# Altium project SDR_LAPAC.PrjPcb (part 1 of 4)
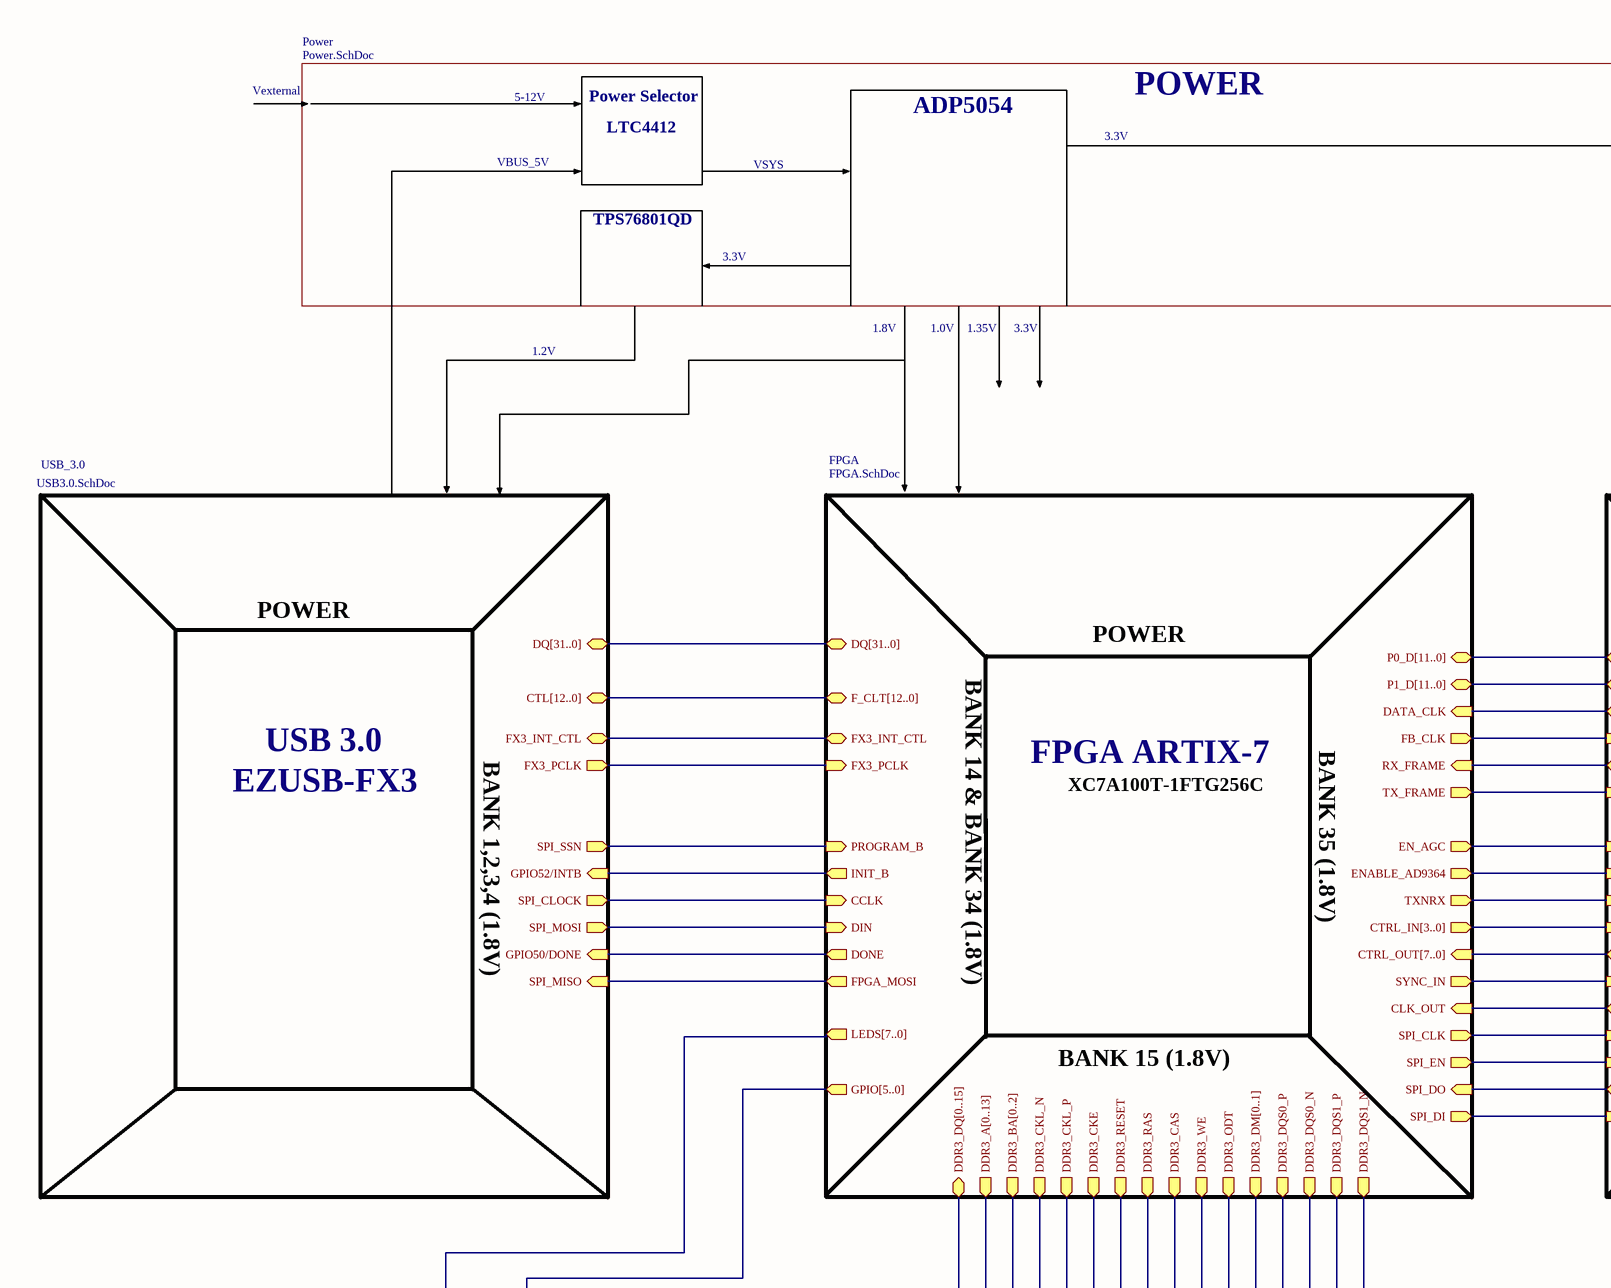
[diagram p0: Intro.SchDoc, top left]
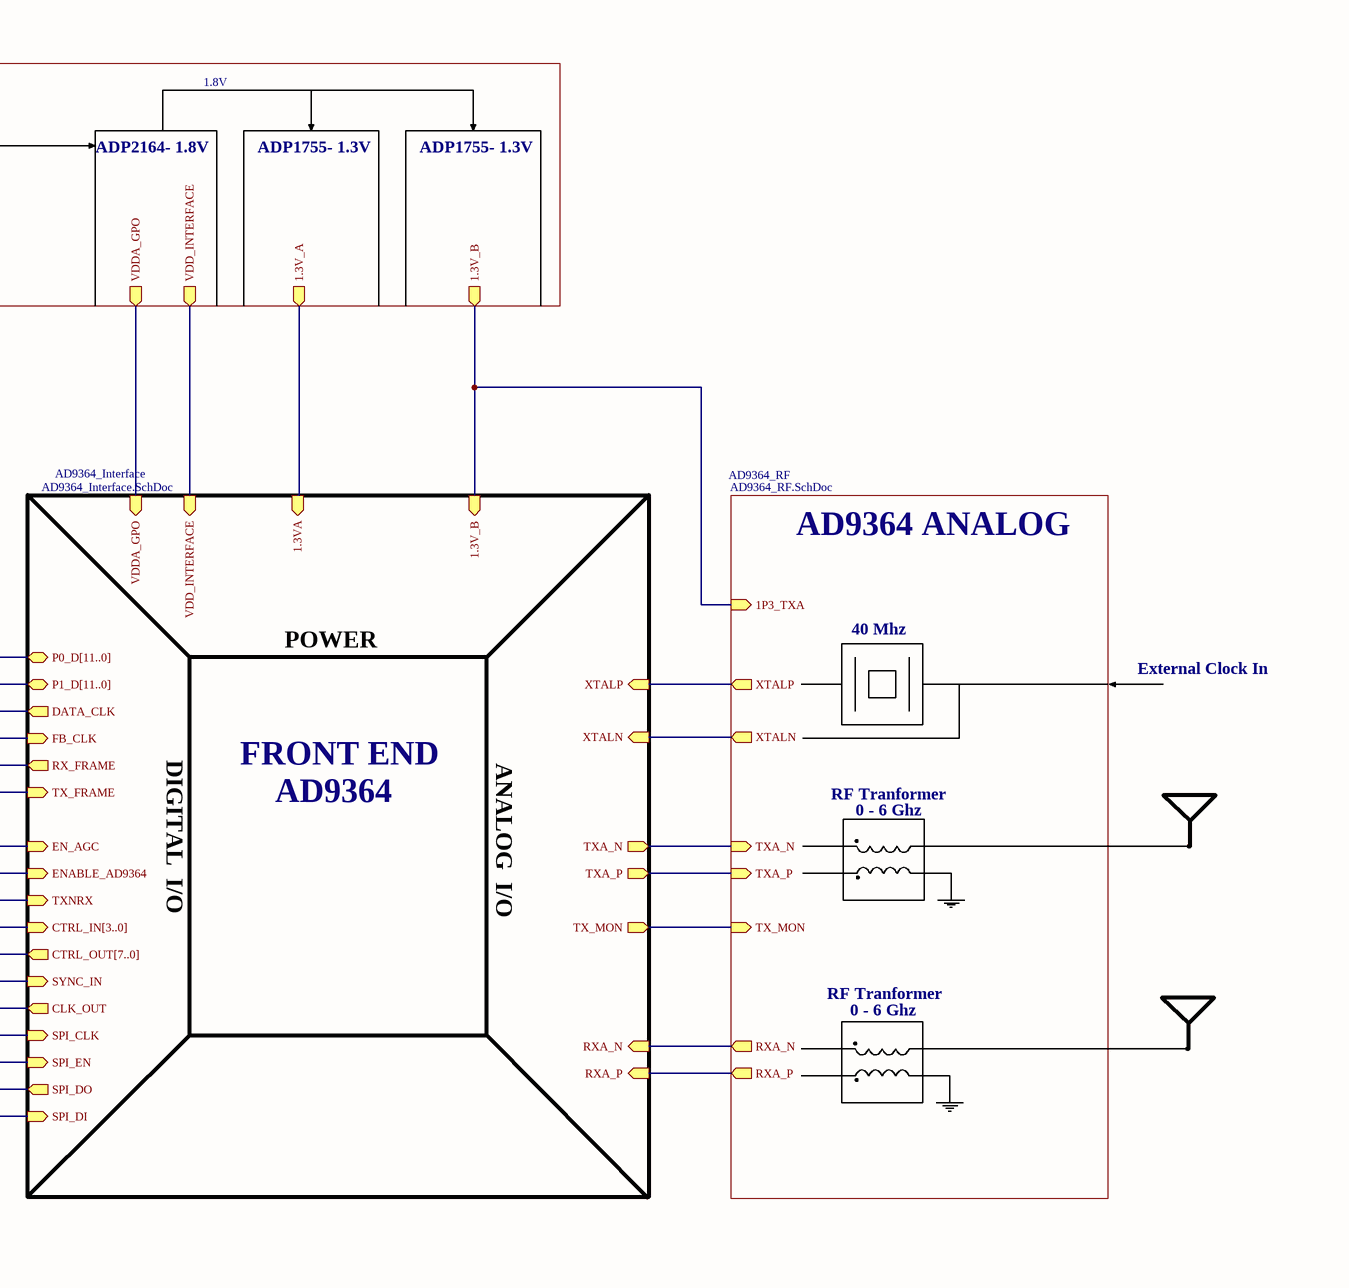
[diagram p1: Intro.SchDoc, top right]
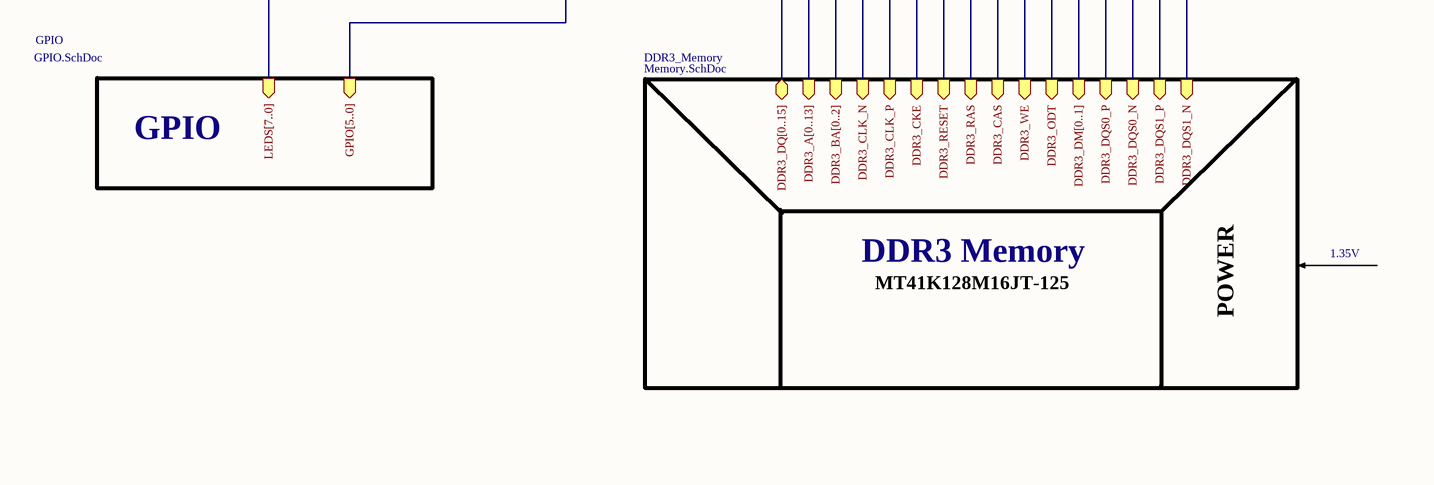
[diagram p2: Intro.SchDoc, bottom left]
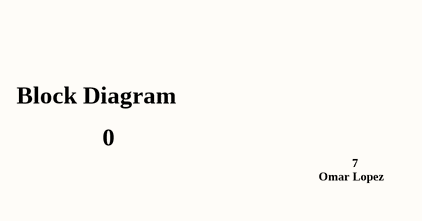
[diagram p3: Intro.SchDoc, bottom right]
8 sheets, 407 parts. Net scope: hierarchical (ports join the sheet entries above them; power ports are global).
Board file: PCB_SDR.PcbDoc
Sheets:
  Intro.SchDoc
    AD9364_Interface = AD9364_Interface.SchDoc
    USB_3.0 = USB3.0.SchDoc
    FPGA = FPGA.SchDoc
    Power = Power.SchDoc
    AD9364_RF = AD9364_RF.SchDoc
    DDR3_Memory = Memory.SchDoc
    GPIO = GPIO.SchDoc

## Sheet Intro.SchDoc
size D; DocumentNumber: 1; SheetNumber: 1

### Sub-sheets
AD9364_Interface = AD9364_Interface.SchDoc: P0_D[11..0] (bidir), P1_D[11..0] (bidir), CTRL_IN[3..0] (in), CTRL_OUT[7..0] (out), DATA_CLK (out), FB_CLK (in), RX_FRAME (out), TX_FRAME (in), ENABLE_AD9364 (in), EN_AGC (in), TXNRX (in), SPI_EN (in), SPI_CLK (in), SPI_DI (in), SPI_DO (out), SYNC_IN (in), CLK_OUT (out), VDD_INTERFACE (in), 1.3V_B (in), 1.3VA (in), VDDA_GPO (in), XTALN (in), XTALP (in), TXA_N (out), TXA_P (out), TX_MON (out), RXA_N (in), RXA_P (in)
AD9364_RF = AD9364_RF.SchDoc: XTALN (out), TXA_N (in), XTALP (out), TXA_P (in), TX_MON (in), RXA_N (out), RXA_P (out), 1P3_TXA (in)
DDR3_Memory = Memory.SchDoc: DDR3_DQ[0..15] (bidir), DDR3_A[0..13] (in), DDR3_BA[0..2] (in), DDR3_CLK_N (in), DDR3_CKE (in), DDR3_RESET (in), DDR3_RAS (in), DDR3_CAS (in), DDR3_WE (in), DDR3_ODT (in), DDR3_DM[0..1] (in), DDR3_DQS0_P (in), DDR3_DQS1_P (in), DDR3_DQS0_N (in), DDR3_DQS1_N (in), DDR3_CLK_P (in)
FPGA = FPGA.SchDoc: P0_D[11..0] (bidir), P1_D[11..0] (bidir), DATA_CLK (in), FB_CLK (out), RX_FRAME (in), TXNRX (out), TX_FRAME (out), EN_AGC (out), ENABLE_AD9364 (out), F_CLT[12..0] (bidir), DQ[31..0] (bidir), FX3_INT_CTL (bidir), FX3_PCLK (in), SPI_DO (in), SPI_EN (out), SPI_CLK (out), CLK_OUT (in), SYNC_IN (out), CTRL_OUT[7..0] (in), CTRL_IN[3..0] (out), SPI_DI (out), DDR3_DQ[0..15] (bidir), DDR3_A[0..13] (out), DDR3_BA[0..2] (out), DDR3_CKL_N (out), DDR3_CKE (out), DDR3_RESET (out), DDR3_RAS (out), DDR3_CAS (out), DDR3_WE (out), DDR3_ODT (out), DDR3_DM[0..1] (out), DDR3_DQS0_P (out), DDR3_DQS1_P (out), DDR3_DQS0_N (out), DDR3_DQS1_N (out), DDR3_CKL_P (out), LEDS[7..0] (out), PROGRAM_B (in), INIT_B (out), CCLK (in), DIN (in), DONE (out), FPGA_MOSI (out), GPIO[5..0] (out)
GPIO = GPIO.SchDoc: LEDS[7..0] (in), GPIO[5..0] (in)
Power = Power.SchDoc: VDD_INTERFACE (out), VDDA_GPO (out), 1.3V_A (out), 1.3V_B (out)
USB_3.0 = USB3.0.SchDoc: FX3_INT_CTL (bidir), FX3_PCLK (out), DQ[31..0] (bidir), CTL[12..0] (bidir), SPI_SSN (out), GPIO52/INTB (in), SPI_CLOCK (out), SPI_MOSI (out), GPIO50/DONE (in), SPI_MISO (in)

### Nets
1.3V_A: sheet AD9364_Interface/1.3VA, sheet Power/1.3V_A
1.3V_B: sheet AD9364_Interface/1.3V_B, sheet Power/1.3V_B, sheet AD9364_RF/1P3_TXA
C_RXA_N: sheet AD9364_Interface/RXA_N, sheet AD9364_RF/RXA_N
C_RXA_P: sheet AD9364_Interface/RXA_P, sheet AD9364_RF/RXA_P
C_TXA_N: sheet AD9364_Interface/TXA_N, sheet AD9364_RF/TXA_N
C_TXA_P: sheet AD9364_Interface/TXA_P, sheet AD9364_RF/TXA_P
CLK_OUT: sheet AD9364_Interface/CLK_OUT, sheet FPGA/CLK_OUT
DATA_CLK: sheet AD9364_Interface/DATA_CLK, sheet FPGA/DATA_CLK
DDR3_CAS: sheet FPGA/DDR3_CAS, sheet DDR3_Memory/DDR3_CAS
DDR3_CKE: sheet FPGA/DDR3_CKE, sheet DDR3_Memory/DDR3_CKE
DDR3_CKL_N: sheet FPGA/DDR3_CKL_N, sheet DDR3_Memory/DDR3_CLK_N
DDR3_CKL_P: sheet FPGA/DDR3_CKL_P, sheet DDR3_Memory/DDR3_CLK_P
DDR3_DQS0_N: sheet FPGA/DDR3_DQS0_N, sheet DDR3_Memory/DDR3_DQS0_N
DDR3_DQS0_P: sheet FPGA/DDR3_DQS0_P, sheet DDR3_Memory/DDR3_DQS0_P
DDR3_DQS1_N: sheet FPGA/DDR3_DQS1_N, sheet DDR3_Memory/DDR3_DQS1_N
DDR3_DQS1_P: sheet FPGA/DDR3_DQS1_P, sheet DDR3_Memory/DDR3_DQS1_P
DDR3_ODT: sheet FPGA/DDR3_ODT, sheet DDR3_Memory/DDR3_ODT
DDR3_RAS: sheet FPGA/DDR3_RAS, sheet DDR3_Memory/DDR3_RAS
DDR3_RESET: sheet FPGA/DDR3_RESET, sheet DDR3_Memory/DDR3_RESET
DDR3_WE: sheet FPGA/DDR3_WE, sheet DDR3_Memory/DDR3_WE
EN_AGC: sheet AD9364_Interface/EN_AGC, sheet FPGA/EN_AGC
ENABLE_AD9364: sheet AD9364_Interface/ENABLE_AD9364, sheet FPGA/ENABLE_AD9364
F_FB_CLK: sheet AD9364_Interface/FB_CLK, sheet FPGA/FB_CLK
F_INT_CTL: sheet USB_3.0/FX3_INT_CTL, sheet FPGA/FX3_INT_CTL
F_PCLK: sheet USB_3.0/FX3_PCLK, sheet FPGA/FX3_PCLK
F_RX_FRAME: sheet AD9364_Interface/RX_FRAME, sheet FPGA/RX_FRAME
F_TX_FRAME: sheet AD9364_Interface/TX_FRAME, sheet FPGA/TX_FRAME
FPGA_CCLK: sheet USB_3.0/SPI_CLOCK, sheet FPGA/CCLK
FPGA_DONE: sheet USB_3.0/GPIO50/DONE, sheet FPGA/DONE
FPGA_PROGRA_B: sheet USB_3.0/SPI_SSN, sheet FPGA/PROGRAM_B
FPGA_SPI_MISO: sheet USB_3.0/SPI_MOSI, sheet FPGA/DIN
FPGA_SPI_MOSI: sheet USB_3.0/SPI_MISO, sheet FPGA/FPGA_MOSI
FX3_GPIO52: sheet USB_3.0/GPIO52/INTB, sheet FPGA/INIT_B
SPI_CLK: sheet AD9364_Interface/SPI_CLK, sheet FPGA/SPI_CLK
SPI_DI: sheet AD9364_Interface/SPI_DI, sheet FPGA/SPI_DI
SPI_DO: sheet AD9364_Interface/SPI_DO, sheet FPGA/SPI_DO
SPI_EN: sheet AD9364_Interface/SPI_EN, sheet FPGA/SPI_EN
SYNC_IN_F: sheet AD9364_Interface/SYNC_IN, sheet FPGA/SYNC_IN
TX_MON: sheet AD9364_Interface/TX_MON, sheet AD9364_RF/TX_MON
TXNRX: sheet AD9364_Interface/TXNRX, sheet FPGA/TXNRX
VDD_INTERFACE: sheet AD9364_Interface/VDD_INTERFACE, sheet Power/VDD_INTERFACE
VDDA_GPO: sheet AD9364_Interface/VDDA_GPO, sheet Power/VDDA_GPO
XTAL_N: sheet AD9364_Interface/XTALN, sheet AD9364_RF/XTALN
XTAL_P: sheet AD9364_Interface/XTALP, sheet AD9364_RF/XTALP

### Buses and harness runs
bus sheet AD9364_Interface/CTRL_IN[3..0] = sheet FPGA/CTRL_IN[3..0]
bus sheet AD9364_Interface/CTRL_OUT[7..0] = sheet FPGA/CTRL_OUT[7..0]
bus sheet AD9364_Interface/P0_D[11..0] = sheet FPGA/P0_D[11..0]
bus sheet AD9364_Interface/P1_D[11..0] = sheet FPGA/P1_D[11..0]
bus sheet DDR3_Memory/DDR3_A[0..13] = sheet FPGA/DDR3_A[0..13]
bus sheet DDR3_Memory/DDR3_BA[0..2] = sheet FPGA/DDR3_BA[0..2]
bus sheet DDR3_Memory/DDR3_DM[0..1] = sheet FPGA/DDR3_DM[0..1]
bus sheet DDR3_Memory/DDR3_DQ[0..15] = sheet FPGA/DDR3_DQ[0..15]
bus sheet FPGA/DQ[31..0] = sheet USB_3.0/DQ[31..0]
bus sheet FPGA/F_CLT[12..0] = sheet USB_3.0/CTL[12..0]
bus sheet FPGA/GPIO[5..0] = sheet GPIO/GPIO[5..0]
bus sheet FPGA/LEDS[7..0] = sheet GPIO/LEDS[7..0]

### Notes on the sheet
- Vexternal
- 5-12V
- Power Selector
- LTC4412
- ADP5054
- 3.3V
- POWER
- 1.8V
- VBUS_5V
- VSYS
- ADP2164- 1.8V
- ADP1755- 1.3V
- TPS76801QD
- 1.0V
- 1.35V
- 1.2V
- AD9364 ANALOG
- 40 Mhz
- External Clock In
- EZUSB-FX3
- USB 3.0
- FPGA ARTIX-7
- XC7A100T-1FTG256C
- FRONT END
- AD9364
- RF Tranformer
- 0 - 6 Ghz
- BANK 1,2,3,4 (1.8V)
- BANK 14 & BANK 34 (1.8V)
- BANK 35 (1.8V)
- DIGITAL  I/O
- ANALOG  I/O
- BANK 15 (1.8V)
- GPIO
- DDR3 Memory
- MT41K128M16JT-125
- Block Diagram
- 0
- Omar Lopez
- 7

## Sheet AD9364_Interface.SchDoc
size C; DocumentNumber: 5; SheetNumber: 5
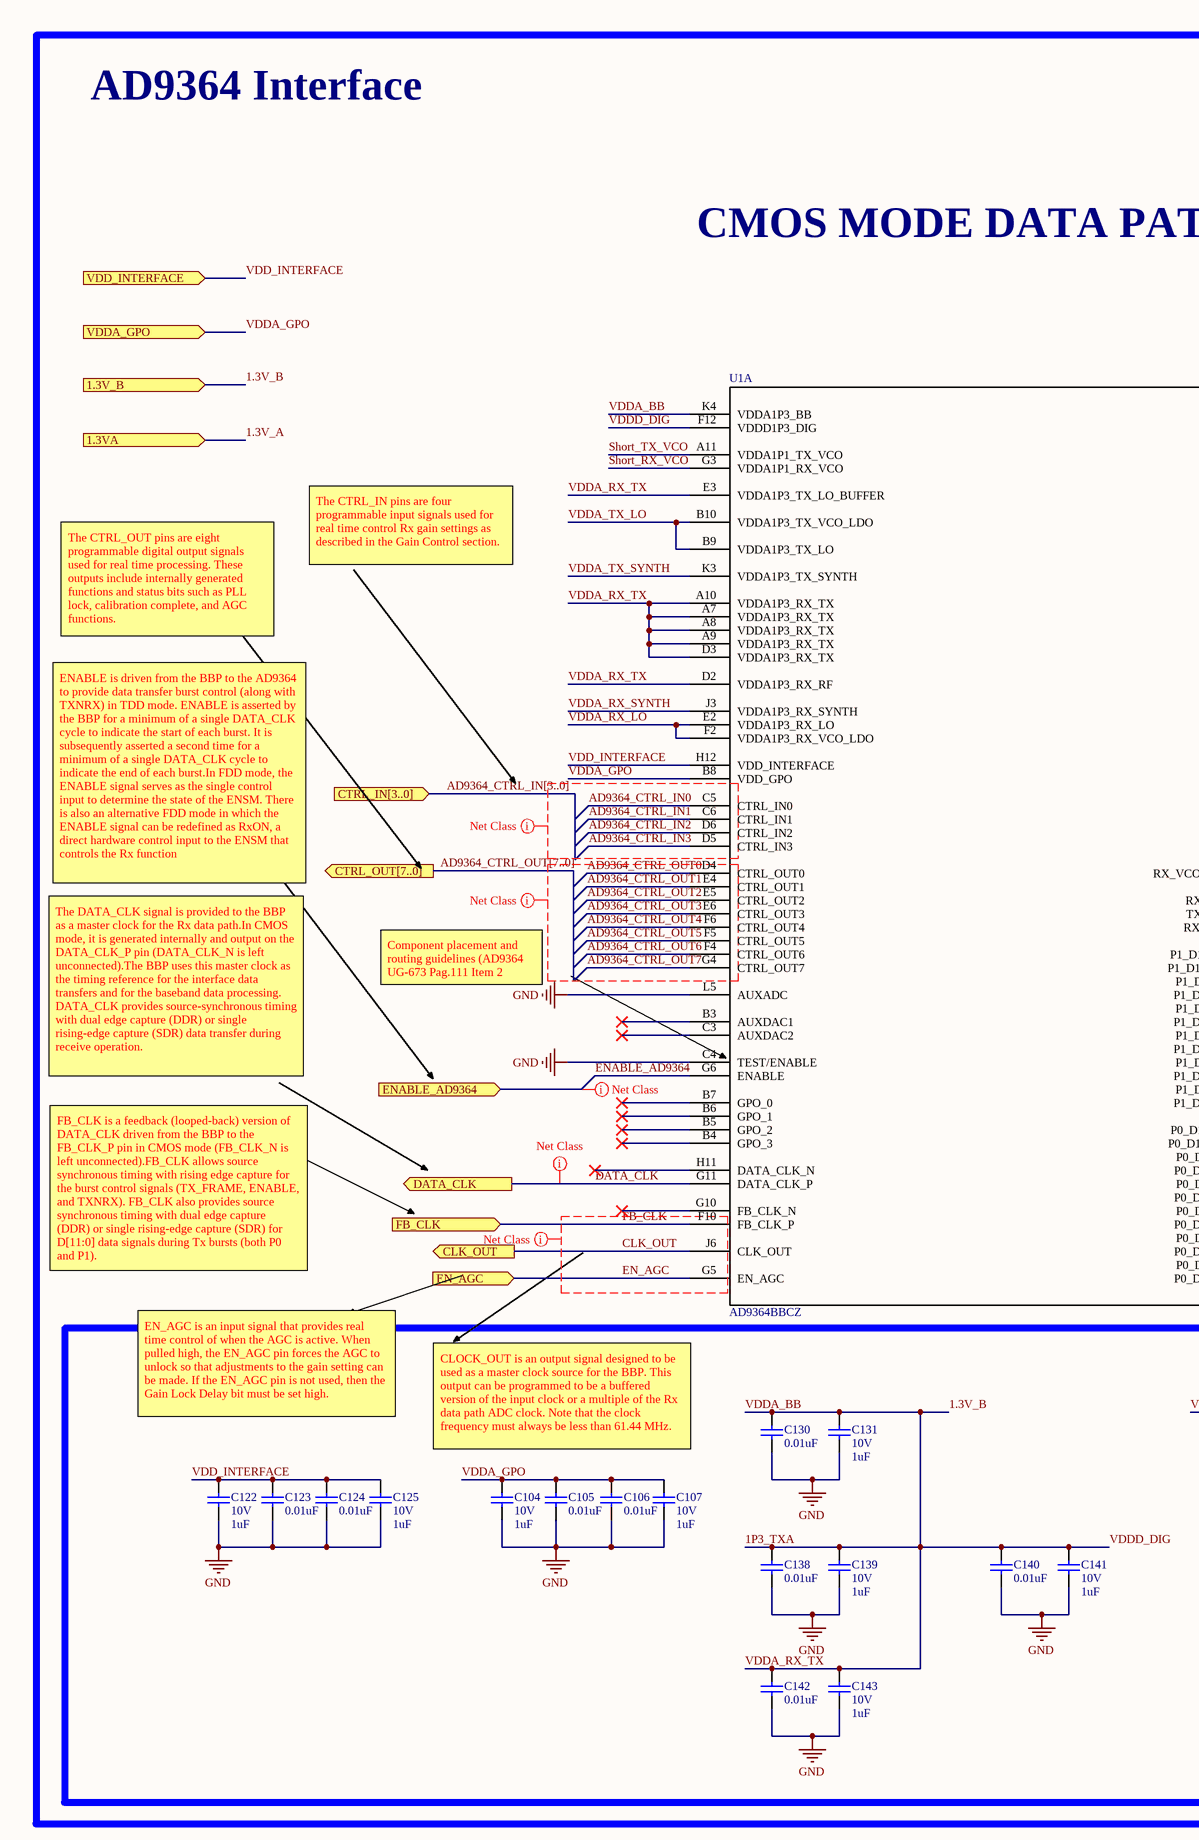
[diagram p4: AD9364_Interface.SchDoc, left]
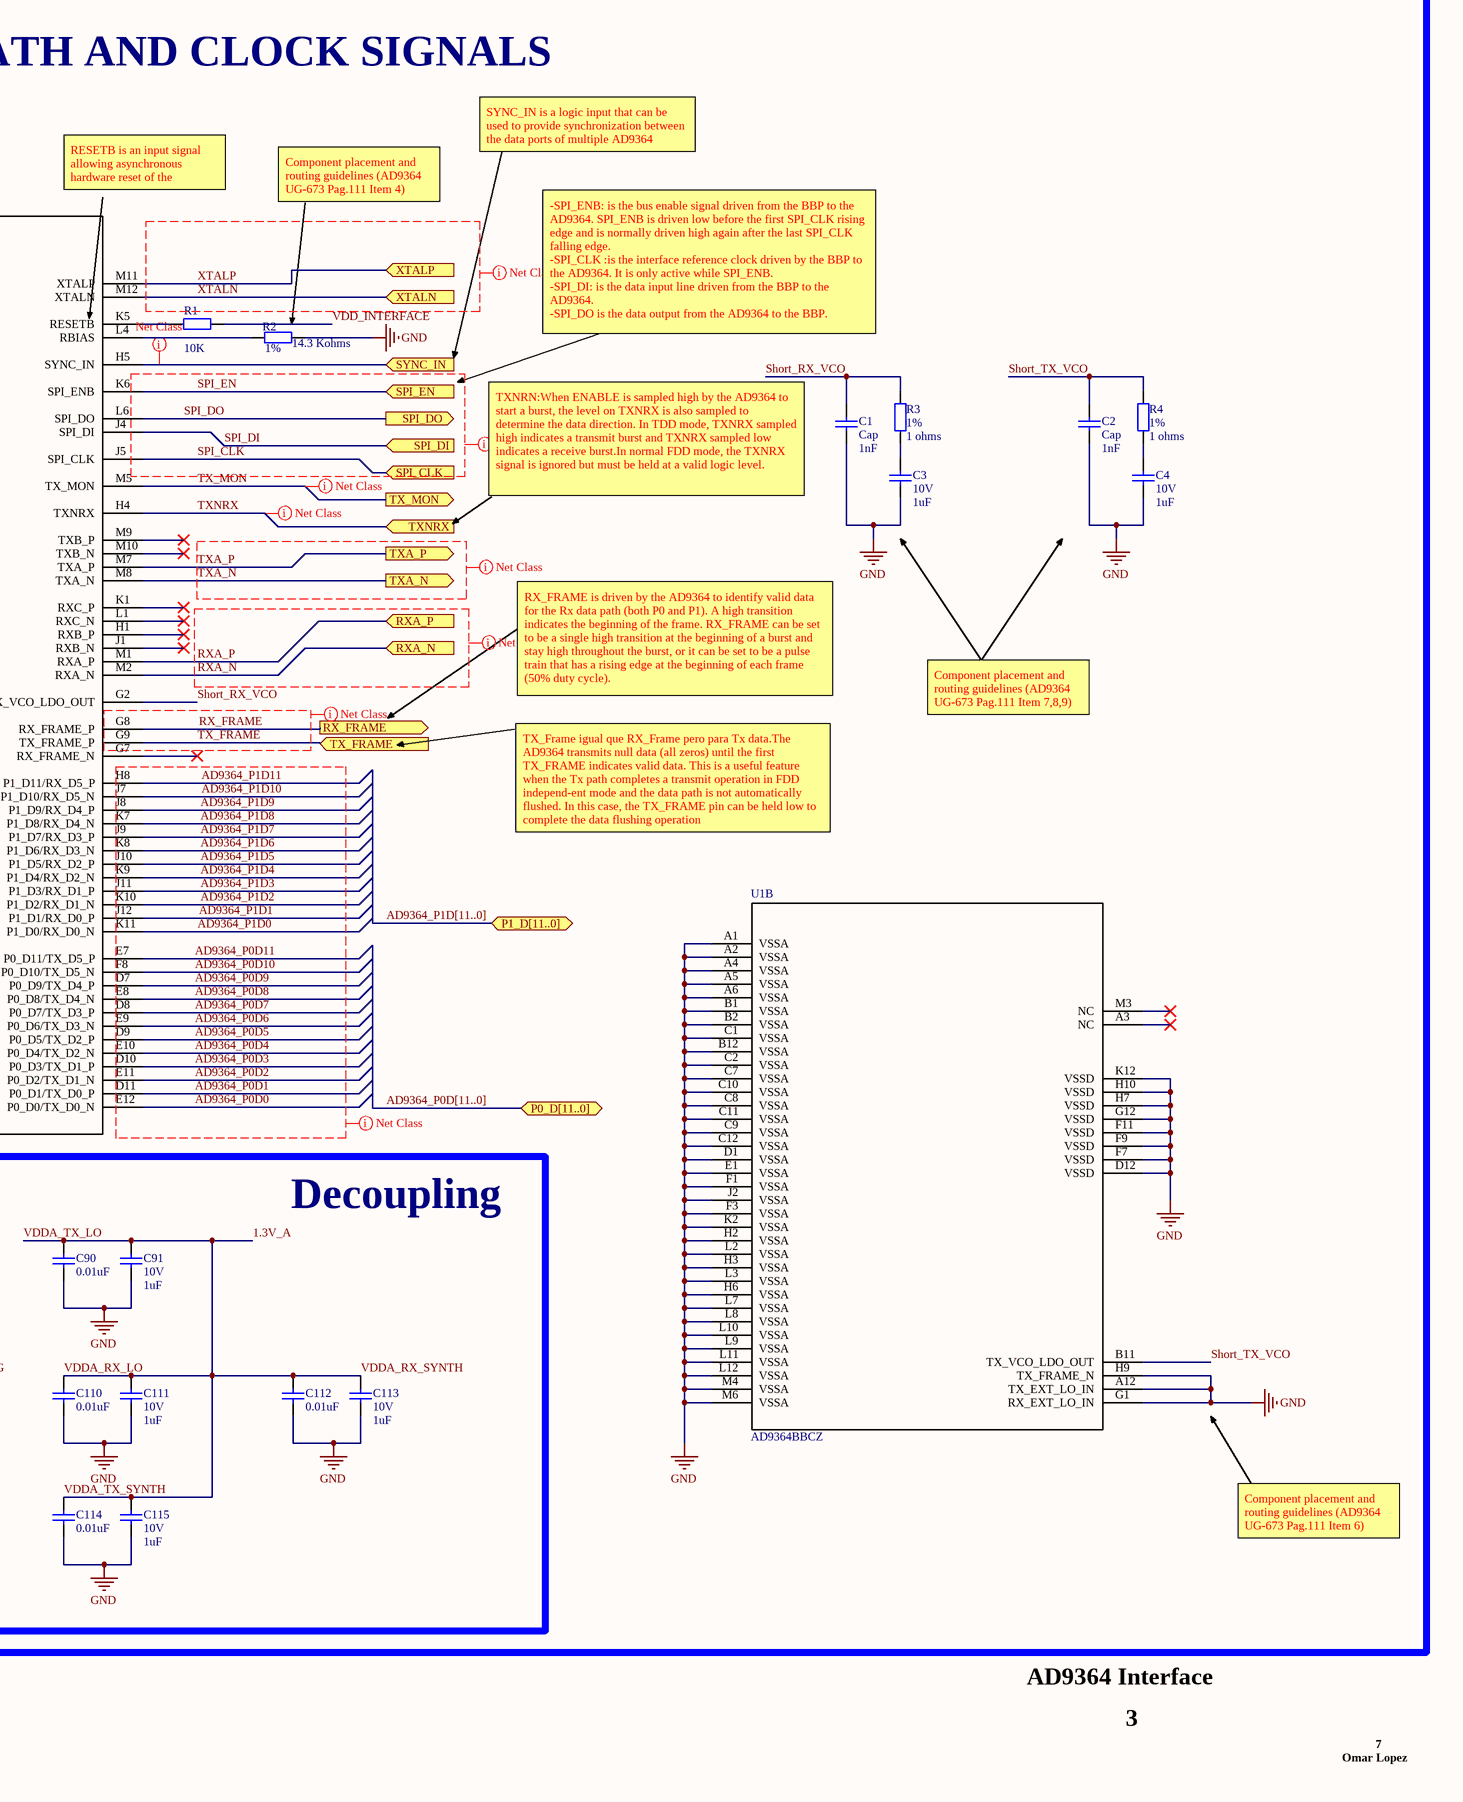
[diagram p5: AD9364_Interface.SchDoc, right]

### Parts
C1  Cap  value 1nF  [GRM0402MurataCap]
C2  Cap  value 1nF  [GRM0402MurataCap]
C3  10V  value 1uF  [GRM0402MurataCap]
C4  10V  value 1uF  [GRM0402MurataCap]
C90  value 0.01uF  [GRM0402MurataCap]  (hidden comment: Cap)
C91  10V  value 1uF  [GRM0402MurataCap]
C104  10V  value 1uF  [GRM0402MurataCap]
C105  value 0.01uF  [GRM0402MurataCap]  (hidden comment: Cap)
C106  value 0.01uF  [GRM0402MurataCap]  (hidden comment: Cap)
C107  10V  value 1uF  [GRM0402MurataCap]
C110  value 0.01uF  [GRM0402MurataCap]  (hidden comment: Cap)
C111  10V  value 1uF  [GRM0402MurataCap]
C112  value 0.01uF  [GRM0402MurataCap]  (hidden comment: Cap)
C113  10V  value 1uF  [GRM0402MurataCap]
C114  value 0.01uF  [GRM0402MurataCap]  (hidden comment: Cap)
C115  10V  value 1uF  [GRM0402MurataCap]
C122  10V  value 1uF  [GRM0402MurataCap]
C123  value 0.01uF  [GRM0402MurataCap]  (hidden comment: Cap)
C124  value 0.01uF  [GRM0402MurataCap]  (hidden comment: Cap)
C125  10V  value 1uF  [GRM0402MurataCap]
C130  value 0.01uF  [GRM0402MurataCap]  (hidden comment: Cap)
C131  10V  value 1uF  [GRM0402MurataCap]
C138  value 0.01uF  [GRM0402MurataCap]  (hidden comment: Cap)
C139  10V  value 1uF  [GRM0402MurataCap]
C140  value 0.01uF  [GRM0402MurataCap]  (hidden comment: Cap)
C141  10V  value 1uF  [GRM0402MurataCap]
C142  value 0.01uF  [GRM0402MurataCap]  (hidden comment: Cap)
C143  10V  value 1uF  [GRM0402MurataCap]
R1  value 10K  [RC0402N]
R2  1%  value 14.3 Kohms  [RC0402N]
R3  1%  value 1 ohms  [RC0402N]
R4  1%  value 1 ohms  [RC0402N]
U1  AD9364BBCZ  [BC_144_7_]  (parts A,B of 2)

### Blocks framed on the sheet
Decoupling: C90 C91 C104-C107 C110-C115 C122-C125 C130 C131 C138-C143

### Ports
1.3V_B (in), 1.3VA (in), CLK_OUT (out), CTRL_IN[3..0] (in), CTRL_OUT[7..0] (out), DATA_CLK (out), EN_AGC (in), ENABLE_AD9364 (in), FB_CLK (in), P0_D[11..0] (bidir), P1_D[11..0] (bidir), RX_FRAME (out), RXA_N (in), RXA_P (in), SPI_CLK (in), SPI_DI (in), SPI_DO (out), SPI_EN (in), SYNC_IN (in), TX_FRAME (in), TX_MON (out), TXA_N (out), TXA_P (out), TXNRX (in), VDD_INTERFACE (in), VDDA_GPO (in), XTALN (in), XTALP (in)

### Nets
GND: C1.2 C2.2 C3.2 C4.2 C90.1 C91.1 C104.1 C105.1 C106.1 C107.1 C110.1 C111.1 C112.1 C113.1 C114.1 C115.1 C122.1 C123.1 C124.1 C125.1 C130.1 C131.1 C138.1 C139.1 C140.1 C141.1 C142.1 C143.1 R2.1 U1.A1(VSSA) U1.A2(VSSA) U1.A4(VSSA) U1.A5(VSSA) U1.A6(VSSA) U1.A12(TX_EXT_LO_IN) U1.B1(VSSA) U1.B2(VSSA) U1.B12(VSSA) U1.C1(VSSA) U1.C2(VSSA) U1.C4(TEST/ENABLE) U1.C7(VSSA) U1.C8(VSSA) U1.C9(VSSA) U1.C10(VSSA) U1.C11(VSSA) U1.C12(VSSA) U1.D1(VSSA) U1.D12(VSSD) U1.E1(VSSA) U1.F1(VSSA) U1.F3(VSSA) U1.F7(VSSD) U1.F9(VSSD) U1.F11(VSSD) U1.G1(RX_EXT_LO_IN) U1.G12(VSSD) U1.H2(VSSA) U1.H3(VSSA) U1.H6(VSSA) U1.H7(VSSD) U1.H9(TX_FRAME_N) U1.H10(VSSD) U1.J2(VSSA) U1.K2(VSSA) U1.K12(VSSD) U1.L2(VSSA) U1.L3(VSSA) U1.L5(AUXADC) U1.L7(VSSA) U1.L8(VSSA) U1.L9(VSSA) U1.L10(VSSA) U1.L11(VSSA) U1.L12(VSSA) U1.M4(VSSA) U1.M6(VSSA)
1.3V_A: C90.2 C91.2 C110.2 C111.2 C112.2 C113.2 C114.2 C115.2 U1.B9(VDDA1P3_TX_LO) U1.B10(VDDA1P3_TX_VCO_LDO) U1.E2(VDDA1P3_RX_LO) U1.F2(VDDA1P3_RX_VCO_LDO) U1.J3(VDDA1P3_RX_SYNTH) U1.K3(VDDA1P3_TX_SYNTH) ; port 1.3VA  [also labelled VDDA_RX_LO, VDDA_RX_SYNTH, VDDA_TX_LO, VDDA_TX_SYNTH]
1.3V_B: C130.2 C131.2 C138.2 C139.2 C140.2 C141.2 C142.2 C143.2 U1.A7(VDDA1P3_RX_TX) U1.A8(VDDA1P3_RX_TX) U1.A9(VDDA1P3_RX_TX) U1.A10(VDDA1P3_RX_TX) U1.D2(VDDA1P3_RX_RF) U1.D3(VDDA1P3_RX_TX) U1.E3(VDDA1P3_TX_LO_BUFFER) U1.F12(VDDD1P3_DIG) U1.K4(VDDA1P3_BB) ; port 1.3V_B  [also labelled 1P3_TXA, VDDA_BB, VDDA_RX_TX, VDDD_DIG]
AD9364_CTRL_IN0: U1.C5(CTRL_IN0)
AD9364_CTRL_IN1: U1.C6(CTRL_IN1)
AD9364_CTRL_IN2: U1.D6(CTRL_IN2)
AD9364_CTRL_IN3: U1.D5(CTRL_IN3)
AD9364_CTRL_OUT0: U1.D4(CTRL_OUT0)
AD9364_CTRL_OUT1: U1.E4(CTRL_OUT1)
AD9364_CTRL_OUT2: U1.E5(CTRL_OUT2)
AD9364_CTRL_OUT3: U1.E6(CTRL_OUT3)
AD9364_CTRL_OUT4: U1.F6(CTRL_OUT4)
AD9364_CTRL_OUT5: U1.F5(CTRL_OUT5)
AD9364_CTRL_OUT6: U1.F4(CTRL_OUT6)
AD9364_CTRL_OUT7: U1.G4(CTRL_OUT7)
AD9364_P0D0: U1.E12(P0_D0/TX_D0_N)
AD9364_P0D1: U1.D11(P0_D1/TX_D0_P)
AD9364_P0D2: U1.E11(P0_D2/TX_D1_N)
AD9364_P0D3: U1.D10(P0_D3/TX_D1_P)
AD9364_P0D4: U1.E10(P0_D4/TX_D2_N)
AD9364_P0D5: U1.D9(P0_D5/TX_D2_P)
AD9364_P0D6: U1.E9(P0_D6/TX_D3_N)
AD9364_P0D7: U1.D8(P0_D7/TX_D3_P)
AD9364_P0D8: U1.E8(P0_D8/TX_D4_N)
AD9364_P0D9: U1.D7(P0_D9/TX_D4_P)
AD9364_P0D10: U1.F8(P0_D10/TX_D5_N)
AD9364_P0D11: U1.E7(P0_D11/TX_D5_P)
AD9364_P1D0: U1.K11(P1_D0/RX_D0_N)
AD9364_P1D1: U1.J12(P1_D1/RX_D0_P)
AD9364_P1D2: U1.K10(P1_D2/RX_D1_N)
AD9364_P1D3: U1.J11(P1_D3/RX_D1_P)
AD9364_P1D4: U1.K9(P1_D4/RX_D2_N)
AD9364_P1D5: U1.J10(P1_D5/RX_D2_P)
AD9364_P1D6: U1.K8(P1_D6/RX_D3_N)
AD9364_P1D7: U1.J9(P1_D7/RX_D3_P)
AD9364_P1D8: U1.K7(P1_D8/RX_D4_N)
AD9364_P1D9: U1.J8(P1_D9/RX_D4_P)
AD9364_P1D10: U1.J7(P1_D10/RX_D5_N)
AD9364_P1D11: U1.H8(P1_D11/RX_D5_P)
CLK_OUT: U1.J6(CLK_OUT) ; port CLK_OUT
DATA_CLK: U1.G11(DATA_CLK_P) ; port DATA_CLK
EN_AGC: U1.G5(EN_AGC) ; port EN_AGC
ENABLE_AD9364: U1.G6(ENABLE) ; port ENABLE_AD9364
FB_CLK: U1.F10(FB_CLK_P) ; port FB_CLK  [project net F_FB_CLK]
RX_FRAME: U1.G8(RX_FRAME_P) ; port RX_FRAME  [project net F_RX_FRAME]
RXA_N: U1.M2(RXA_N) ; port RXA_N  [project net C_RXA_N]
RXA_P: U1.M1(RXA_P) ; port RXA_P  [project net C_RXA_P]
Short_RX_VCO: C1.1 R3.1 U1.G2(RX_VCO_LDO_OUT) U1.G3(VDDA1P1_RX_VCO)
Short_TX_VCO: C2.1 R4.1 U1.A11(VDDA1P1_TX_VCO) U1.B11(TX_VCO_LDO_OUT)
SPI_CLK: U1.J5(SPI_CLK) ; port SPI_CLK
SPI_DI: U1.J4(SPI_DI) ; port SPI_DI
SPI_DO: U1.L6(SPI_DO) ; port SPI_DO
SPI_EN: U1.K6(SPI_ENB) ; port SPI_EN
SYNC_IN_F: U1.H5(SYNC_IN) ; port SYNC_IN
TX_FRAME: U1.G9(TX_FRAME_P) ; port TX_FRAME  [project net F_TX_FRAME]
TX_MON: U1.M5(TX_MON) ; port TX_MON
TXA_N: U1.M8(TXA_N) ; port TXA_N  [project net C_TXA_N]
TXA_P: U1.M7(TXA_P) ; port TXA_P  [project net C_TXA_P]
TXNRX: U1.H4(TXNRX) ; port TXNRX
VDD_INTERFACE: C122.2 C123.2 C124.2 C125.2 R1.1 U1.H12(VDD_INTERFACE) ; port VDD_INTERFACE
VDDA_GPO: C104.2 C105.2 C106.2 C107.2 U1.B8(VDD_GPO) ; port VDDA_GPO
XTALN: U1.M12(XTALN) ; port XTALN  [project net XTAL_N]
XTALP: U1.M11(XTALP) ; port XTALP  [project net XTAL_P]
NetC3_1: C3.1 R3.2
NetC4_1: C4.1 R4.2
NetR1_2: R1.2 U1.K5(RESETB)
NetR2_2: R2.2 U1.L4(RBIAS)

Not connected (* = marked no-connect by the designer): U1 A3(NC)* B3(AUXDAC1)* B4(GPO_3)* B5(GPO_2)* B6(GPO_1)* B7(GPO_0)* C3(AUXDAC2)* G7(RX_FRAME_N)* G10(FB_CLK_N)* H1(RXB_P)* H11(DATA_CLK_N)* J1(RXB_N)* K1(RXC_P)* L1(RXC_N)* M3(NC)* M9(TXB_P)* M10(TXB_N)*

### Buses and harness runs
bus AD9364_CTRL_IN[3..0] = port CTRL_IN[3..0]
bus AD9364_CTRL_OUT[7..0] = port CTRL_OUT[7..0]
bus AD9364_P0D[11..0] = port P0_D[11..0]
bus AD9364_P1D[11..0] = port P1_D[11..0]

### Layout directives
net class AD9364_Digital; net class AD9364_DataPorts: AD9364_P0D0, AD9364_P0D1, AD9364_P0D2, AD9364_P0D3, AD9364_P0D4, AD9364_P0D5, AD9364_P0D6, AD9364_P0D7, AD9364_P0D8, AD9364_P0D9, AD9364_P0D10, AD9364_P0D11, AD9364_P1D0, AD9364_P1D1, AD9364_P1D2, AD9364_P1D3, AD9364_P1D4, AD9364_P1D5, AD9364_P1D6, AD9364_P1D7, AD9364_P1D8, AD9364_P1D9, AD9364_P1D10, AD9364_P1D11
net class AD9364_Digital; net class AD9364_CTRL_OUT[7..0]: AD9364_CTRL_OUT0, AD9364_CTRL_OUT1, AD9364_CTRL_OUT2, AD9364_CTRL_OUT3, AD9364_CTRL_OUT4, AD9364_CTRL_OUT5, AD9364_CTRL_OUT6, AD9364_CTRL_OUT7
net class AD9364_Digital; net class AD9364_SPI_4Wires: SPI_CLK, SPI_DI, SPI_DO, SPI_EN
net class AD9364_Digital; net class AD9364_Other: CLK_OUT, DATA_CLK, EN_AGC, ENABLE_AD9364, FB_CLK, RX_FRAME, SYNC_IN_F, TX_FRAME, TXNRX
net class AD9364_Digital; net class AD9364_CTRL_IN[3..0]: AD9364_CTRL_IN0, AD9364_CTRL_IN1, AD9364_CTRL_IN2, AD9364_CTRL_IN3
net class AD9364_RF; net class AD9364_Clock: XTALN, XTALP
net class AD9364_RF; net class AD9364_Rx: RXA_N, RXA_P
net class AD9364_RF; net class AD9364_TxMon: TX_MON
net class AD9364_RF; net class AD9364_Tx: TXA_N, TXA_P

### Notes on the sheet
- AD9364 Interface
- CMOS MODE DATA PATH AND CLOCK SIGNALS
- SYNC_IN is a logic input that can be used to provide synchronization between the data ports of multiple AD9364 devices.
- RESETB is an input signal allowing asynchronous hardware reset of the AD9364.
- Component placement and routing guidelines (AD9364 UG-673 Pag.111 Item 4)
- -SPI_ENB: is the bus enable signal driven from the BBP to the AD9364. SPI_ENB is driven low before the first SPI_CLK rising edge and is normally driven high again after the last SPI_CLK falling edge.
  -SPI_CLK :is the interface reference clock driven by the BBP to the AD9364. It is only active while SPI_ENB.
  -SPI_DI: is the data input line driven from the BBP to the AD9364.
  -SPI_DO is the data output from the AD9364 to the BBP.
- The CTRL_IN pins are four programmable input signals used for real time control Rx gain settings as described in the Gain Control section.
- The CTRL_OUT pins are eight programmable digital output signals used for real time processing. These outputs include internally generated functions and status bits such as PLL lock, calibration complete, and AGC functions.
- (near C1) TXNRN:When ENABLE is sampled high by the AD9364 to start a burst, the level on TXNRX is also sampled to determine the data direction. In TDD mode, TXNRX sampled high indicates a transmit burst and TXNRX sampled low indicates a receive burst.In normal FDD mode, the TXNRX signal is ignored but must be held at a valid logic level.
- ENABLE is driven from the BBP to the AD9364 to provide data transfer burst control (along with TXNRX) in TDD mode. ENABLE is asserted by the BBP for a minimum of a single DATA_CLK cycle to indicate the start of each burst. It is subsequently asserted a second time for a minimum of a single DATA_CLK cycle to indicate the end of each burst.In FDD mode, the ENABLE signal serves as the single control input to determine the state of the ENSM. There is also an alternative FDD mode in which the ENABLE signal can be redefined as RxON, a direct hardware control input to the ENSM that controls the Rx function
- RX_FRAME is driven by the AD9364 to identify valid data for the Rx data path (both P0 and P1). A high transition indicates the beginning of the frame. RX_FRAME can be set to be a single high transition at the beginning of a burst and stay high throughout the burst, or it can be set to be a pulse train that has a rising edge at the beginning of each frame (50% duty cycle).
- Component placement and routing guidelines (AD9364 UG-673 Pag.111 Item 7,8,9)
- Component placement and routing guidelines (AD9364 UG-673 Pag.111 Item 2
  )
- TX_Frame igual que RX_Frame pero para Tx data.The AD9364 transmits null data (all zeros) until the first TX_FRAME indicates valid data. This is a useful feature when the Tx path completes a transmit operation in FDD independ-ent mode and the data path is not automatically flushed. In this case, the TX_FRAME pin can be held low to complete the data flushing operation
- The DATA_CLK signal is provided to the BBP as a master clock for the Rx data path.In CMOS mode, it is generated internally and output on the DATA_CLK_P pin (DATA_CLK_N is left unconnected).The BBP uses this master clock as the timing reference for the interface data transfers and for the baseband data processing. DATA_CLK provides source-synchronous timing with dual edge capture (DDR) or single rising-edge capture (SDR) data transfer during receive operation.
- FB_CLK is a feedback (looped-back) version of DATA_CLK driven from the BBP to the FB_CLK_P pin in CMOS mode (FB_CLK_N is left unconnected).FB_CLK allows source synchronous timing with rising edge capture for the burst control signals (TX_FRAME, ENABLE, and TXNRX). FB_CLK also provides source synchronous timing with dual edge capture (DDR) or single rising-edge capture (SDR) for D[11:0] data signals during Tx bursts (both P0 and P1).
- EN_AGC is an input signal that provides real time control of when the AGC is active. When pulled high, the EN_AGC pin forces the AGC to unlock so that adjustments to the gain setting can be made. If the EN_AGC pin is not used, then the Gain Lock Delay bit must be set high.
- CLOCK_OUT is an output signal designed to be used as a master clock source for the BBP. This output can be programmed to be a buffered version of the input clock or a multiple of the Rx data path ADC clock. Note that the clock frequency must always be less than 61.44 MHz.
- Component placement and routing guidelines (AD9364 UG-673 Pag.111 Item 6)
- 3
- Omar Lopez
- 7

### Library data of the parts
C1 C2 = Cap: Capacitor; Manufacturer: Murata; PartNumber: GRM1555C1H102FA01D; Tolerance: 10%; Descripción: 50V SMD; CostoVendedor1: 0.25; Vendedor1: Mouser; Vendedor2: Digi-Key; Package: 0402; DataSheet: http://www.mouser.com/ds/2/281/c02e-2905.pdf; LinkVendedor1: https://ar.mouser.com/ProductDetail/Murata-Electronics/GRM1555C1H102FA01D?qs=sGAEpiMZZMs0AnBnWHyRQHS%2f3XE0oMwxlJflngdMc0Y%3d; Stock1: 95000
C3 C4 C91 C104 C107 C111 C113 C115 C122 C125 C131 C139 C141 C143 = Cap: Capacitor; Manufacturer: Murata; PartNumber: GRM155C81E105KE11D; Tolerance: 10%; Descripción: SMD/SMT 0402 1uF 6.3volts X5R 10%; CostoVendedor2: 0.3; Vendedor1: Mouser; Vendedor2: Digi-Key; Package: 0402; DataSheet: http://www.mouser.com/ds/2/281/c02e-2905.pdf; LinkVendedor2: https://www.digikey.com/product-detail/en/murata-electronics-north-america/GRM155C81E105KE11D/490-10014-1-ND/5026352; Stock2: 4000
C90 C105 C106 C110 C112 C114 C123 C124 C130 C138 C140 C142 = Cap: Capacitor; Manufacturer: Murata; PartNumber: GCG155L81E103KA01D; Tolerance: 10%; Descripción: SMD/SMT 0402 0.01uF 25volts X7R 10%; CostoVendedor1: 0.19; Vendedor1: Mouser; Vendedor2: Digi-Key; Package: 0402; DataSheet: https://ar.mouser.com/datasheet/2/281/c03e-516224.pdf; LinkVendedor1: https://ar.mouser.com/ProductDetail/Murata-Electronics/GCG155L81E103KA01D?qs=sGAEpiMZZMs0AnBnWHyRQID2xuQsFd1G0H3MNkFLCyvrnbiUuoaHUg%3d%3d; Stock1: 8800
R1 = Res2: Resistor; Manufacturer: Panasonic; PartNumber: ERJ-2RKF1002X; Tolerance: 1%; Descripción: 100mW 50V; CostoVendedor1: 0.021; Vendedor1: Mouser; Vendedor2: Digi-Key; Package: 0402; DataSheet: http://www.mouser.com/ds/2/315/AOA0000C86-911473.pdf; LinkVendedor1: https://ar.mouser.com/ProductDetail/Panasonic-Industrial-Devices/ERJ-2RKF1002X?qs=%2fha2pyFadujciewGcSbxYCeocmJ1V0ffuiBNpRUU2nm5e2XaRJ685Q%3d%3d; Stock1: 2000000
R2 = Res2: Resistor; Manufacturer: Panasonic; PartNumber: ERJ-2RKF1432X; Descripción: 100mw 50V; Vendedor1: Mouser; Vendedor2: Digi-Key; Package: 0402; Tolerance: 1%; DataSheet: http://www.mouser.com/ds/2/315/AOA0000C283-1093288.pdf
R3 R4 = Res2: Resistor; Manufacturer: Panasonic; PartNumber: ERJ-2BQJ1R0X; Tolerance: 5%; Descripción: Resistores de detección de corriente - SMD Thick Film Chip R, 0402, Low ohmic, 5%; CostoVendedor1: 0.37; Vendedor1: Mouser; Vendedor2: Digi-Key; Package: 0402; DataSheet: http://www.mouser.com/ds/2/315/AOA0000C283-1093288.pdf; LinkVendedor1: https://ar.mouser.com/ProductDetail/Panasonic/ERJ-2BQJ1R0X?qs=sGAEpiMZZMtlleCFQhR%2fzZ0wbLhD%252bede7FN8GfckIhM%3d; Stock1: 8500
U1 = AD9364BBCZ: Transceiver; Manufacturer: Analog Devices; CostoVendedor1: 176; CostoVendedor2: 200; Requerimiento: Disponible 26 de Julio; Vendedor1: Mouser; Vendedor2: Digi-Key; Value: Value; DataSheet: http://www.mouser.com/ds/2/609/AD9364-586828.pdf; Descripción: Transceiver; PartNumber: AD9364BBCZ; LinkVendedor1: https://ar.mouser.com/ProductDetail/Analog-Devices/AD9364BBCZ?qs=sGAEpiMZZMt%252bz66QWnul0XZd%2fXb1tNSbHpa03Fwpc7M%3d; LinkVendedor2: https://www.digikey.com/product-detail/en/analog-devices-inc/AD9364BBCZ/AD9364BBCZ-ND/4747823?utm_campaign=buynow&utm_medium=aggregator&WT.z_cid=ref_findchips_standard&utm_source=findchips; Stock1: 0; Stock2: 508

## Sheet USB3.0.SchDoc
size D; DocumentNumber: 3; SheetNumber: 3
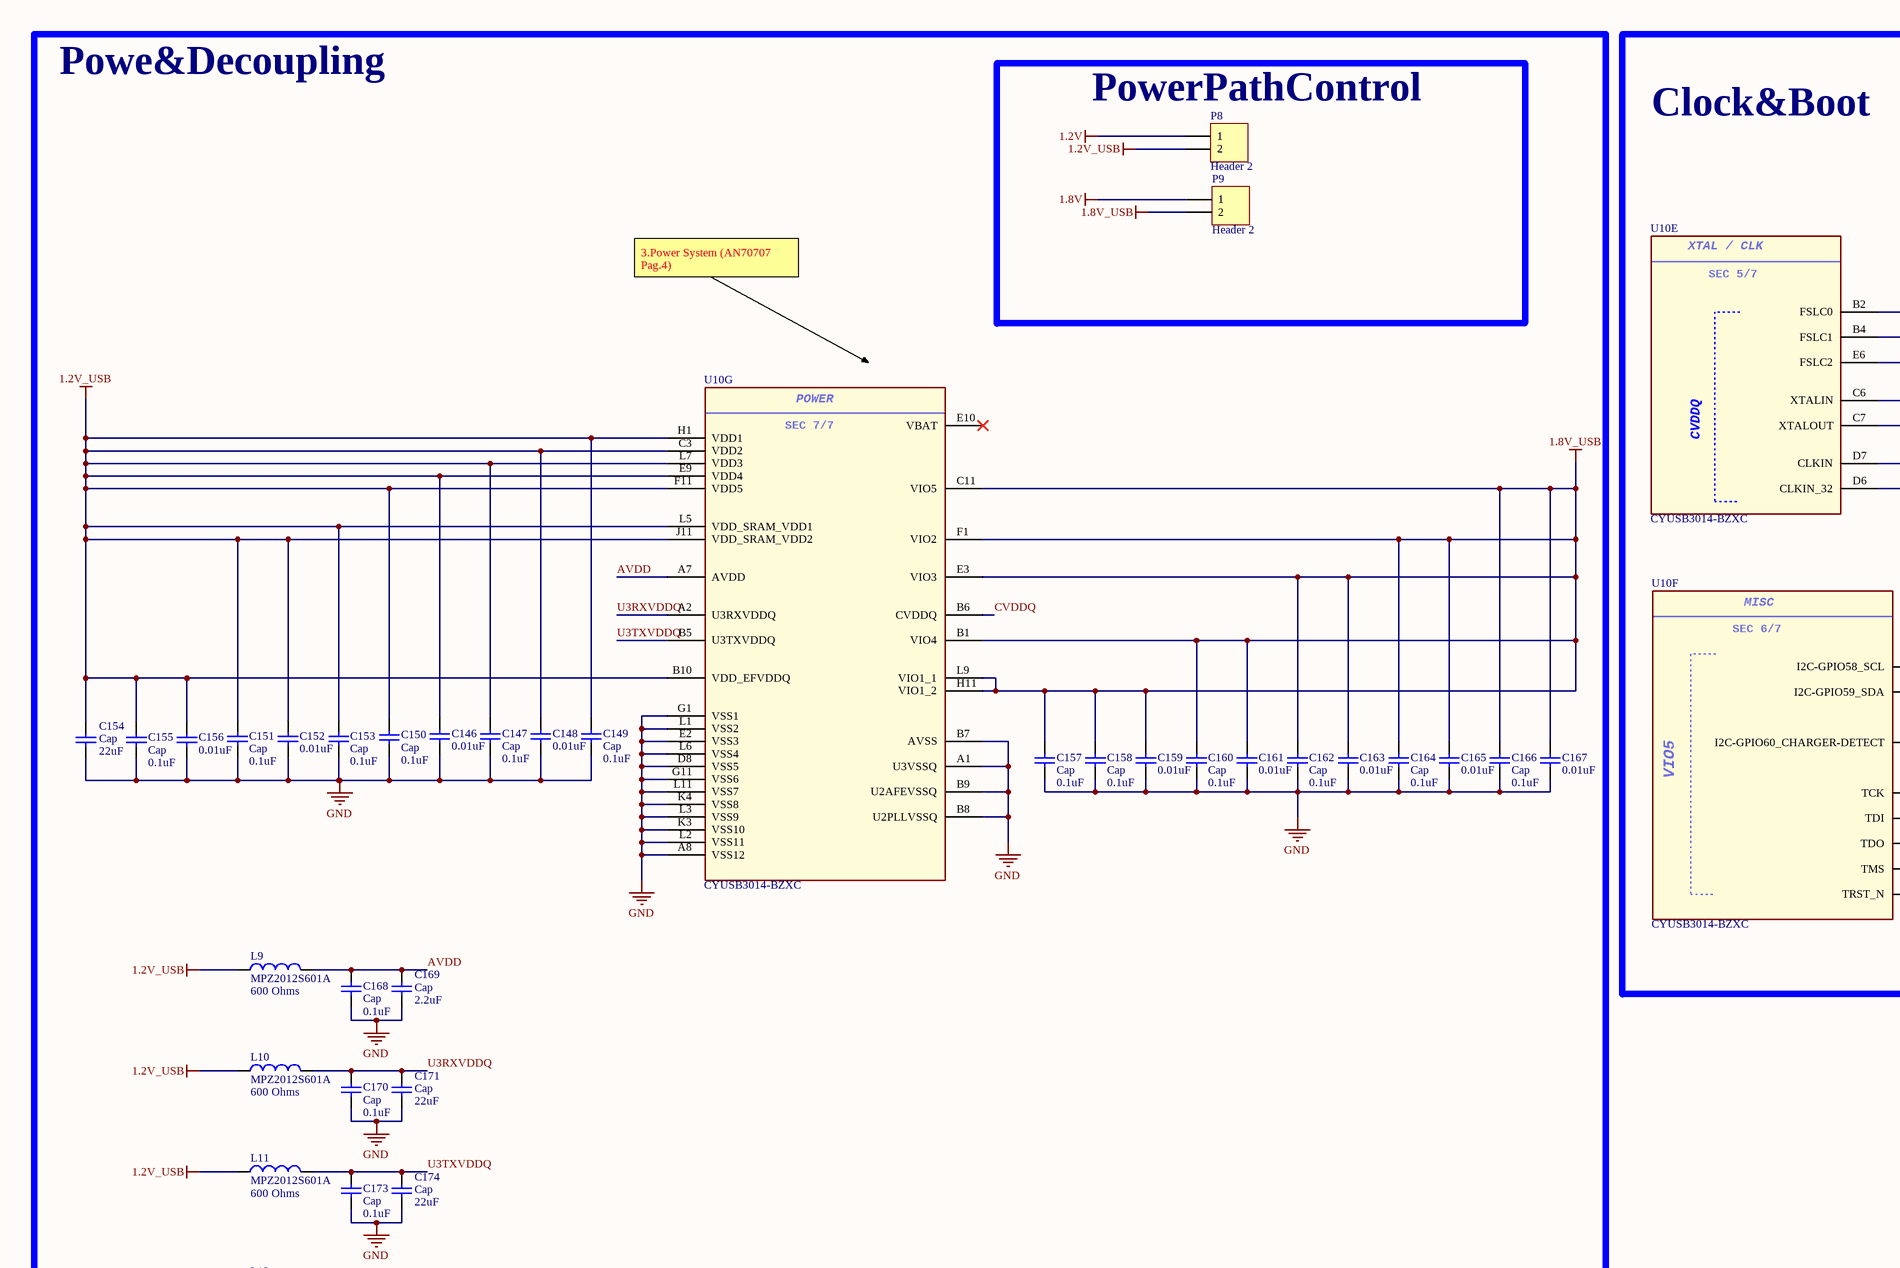
[diagram p6: USB3.0.SchDoc, top left]
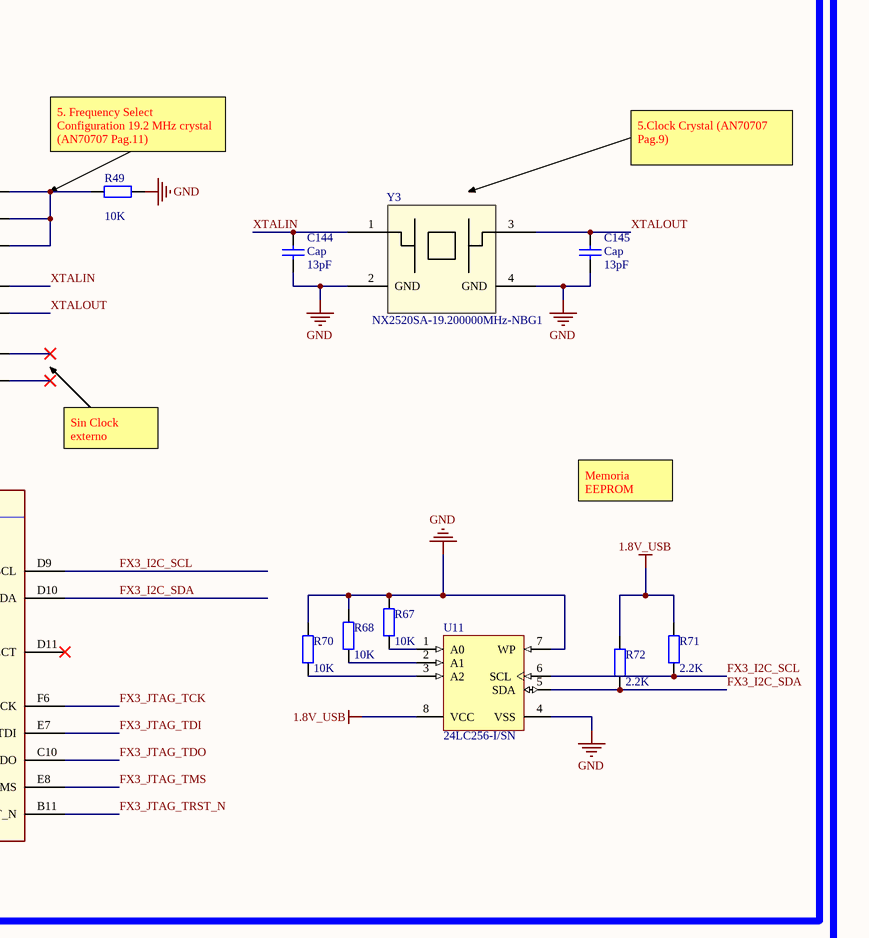
[diagram p7: USB3.0.SchDoc, top middle]
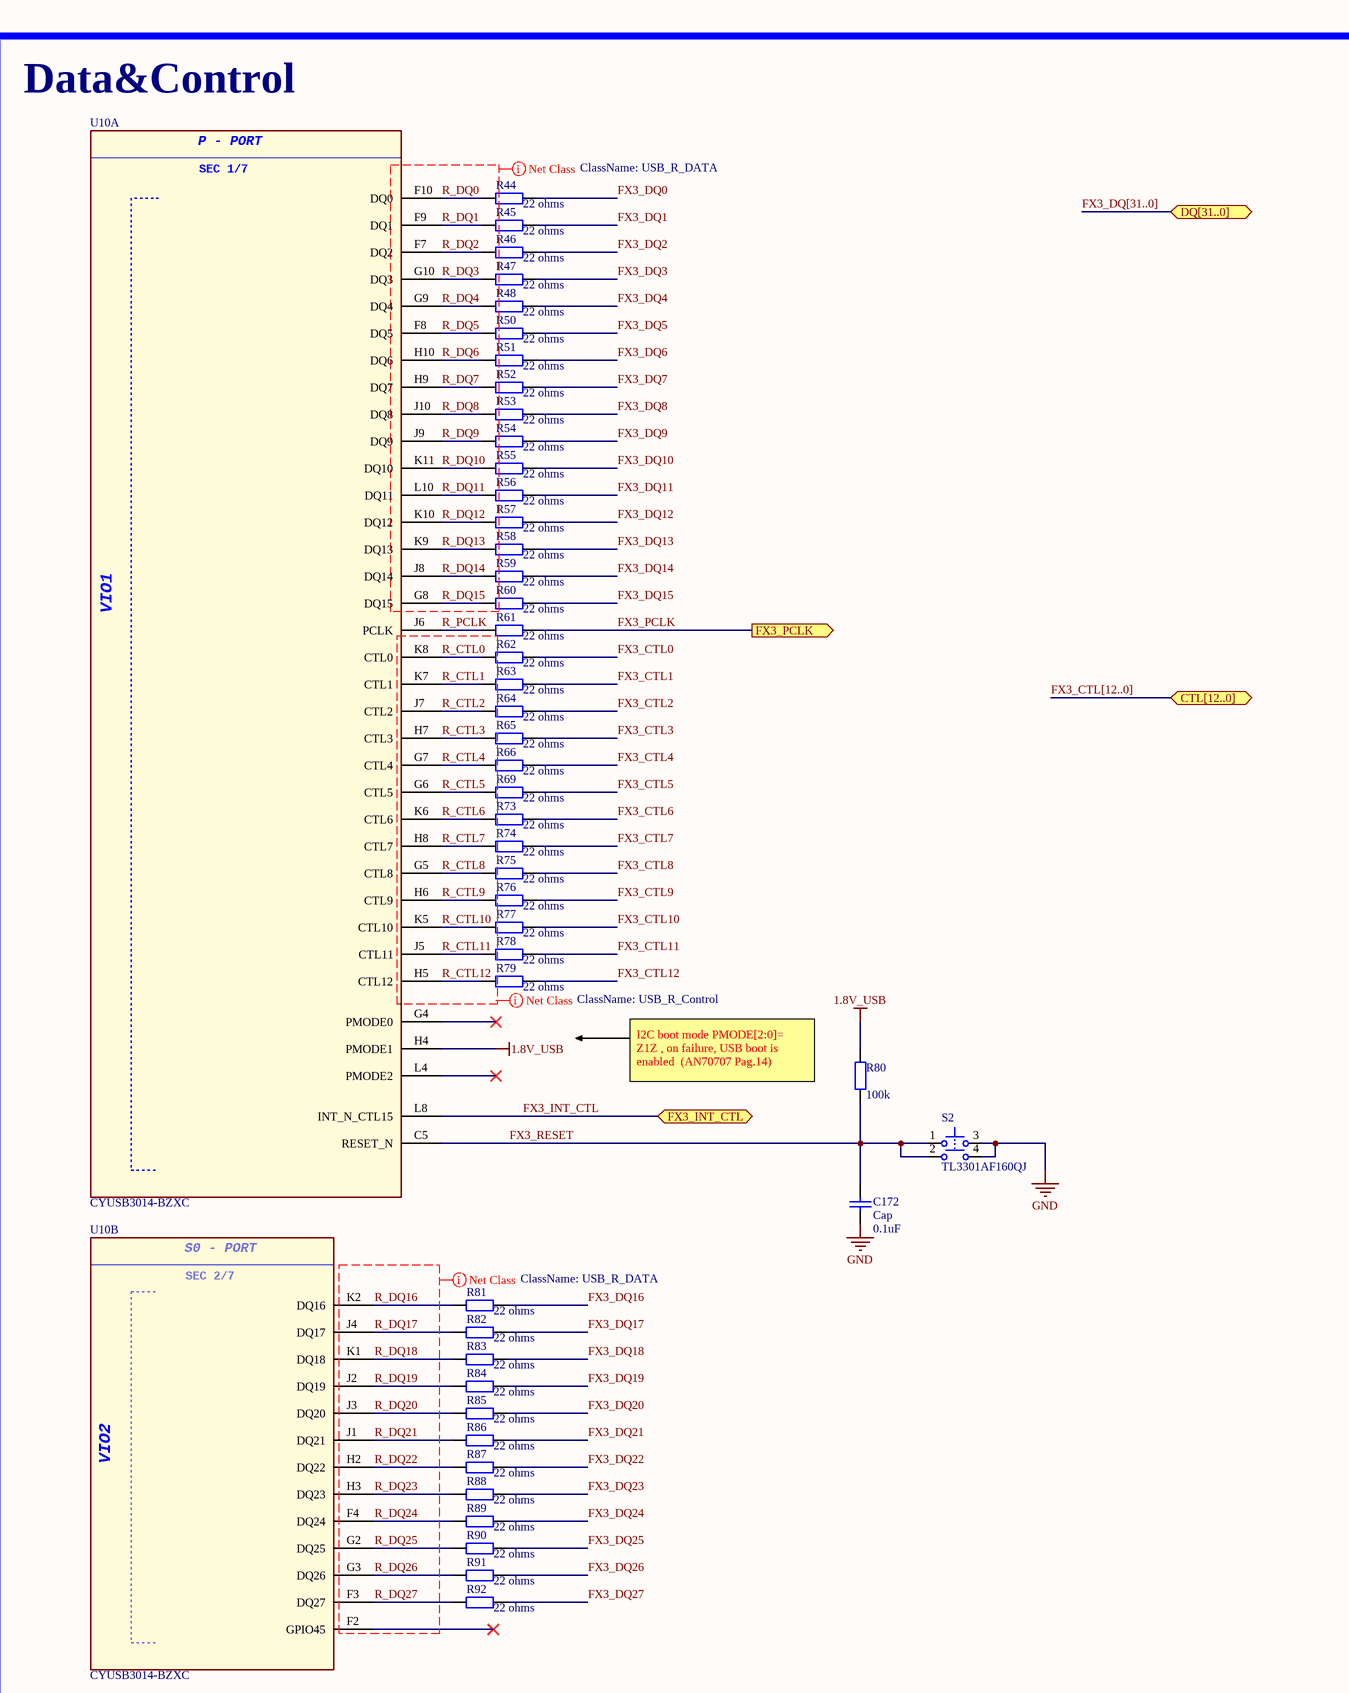
[diagram p8: USB3.0.SchDoc, top right]
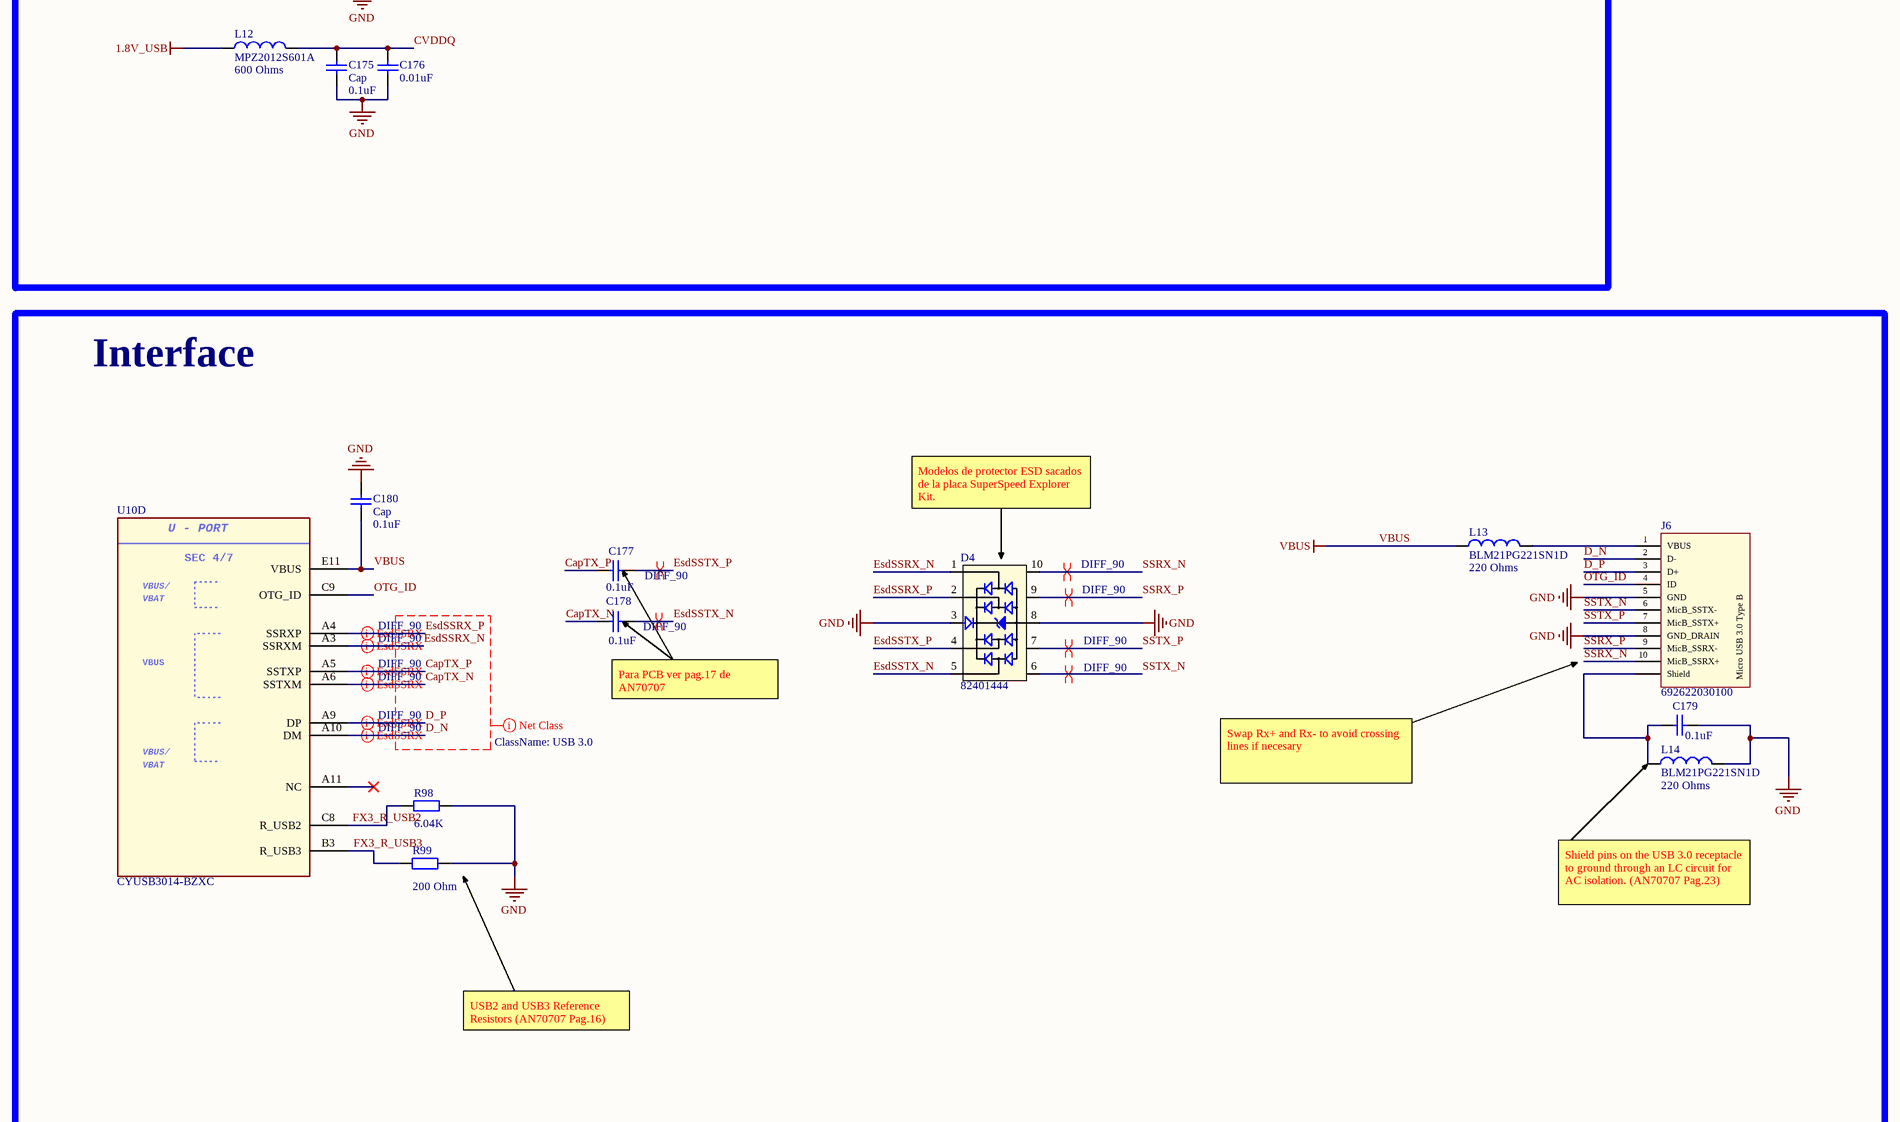
[diagram p9: USB3.0.SchDoc, bottom left]
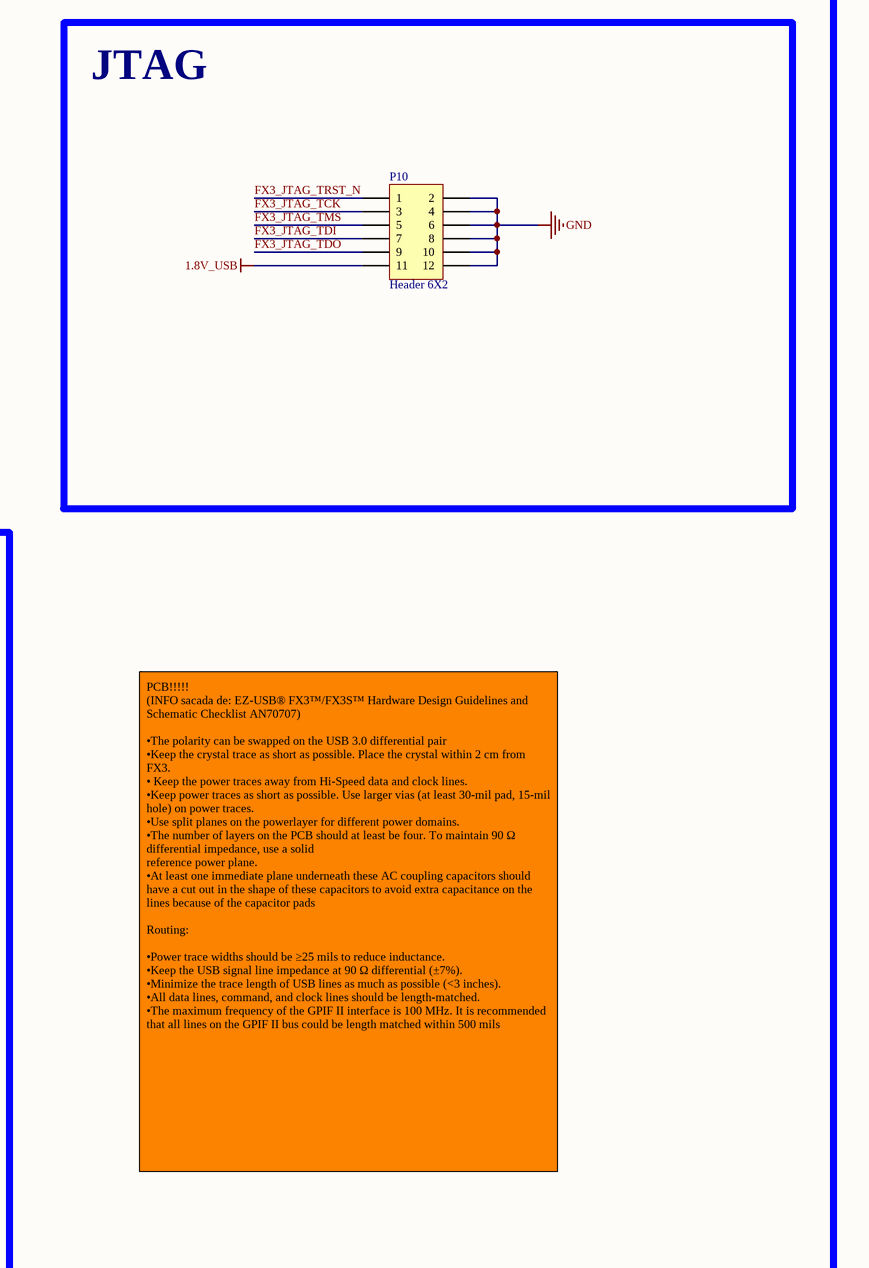
[diagram p10: USB3.0.SchDoc, bottom middle]
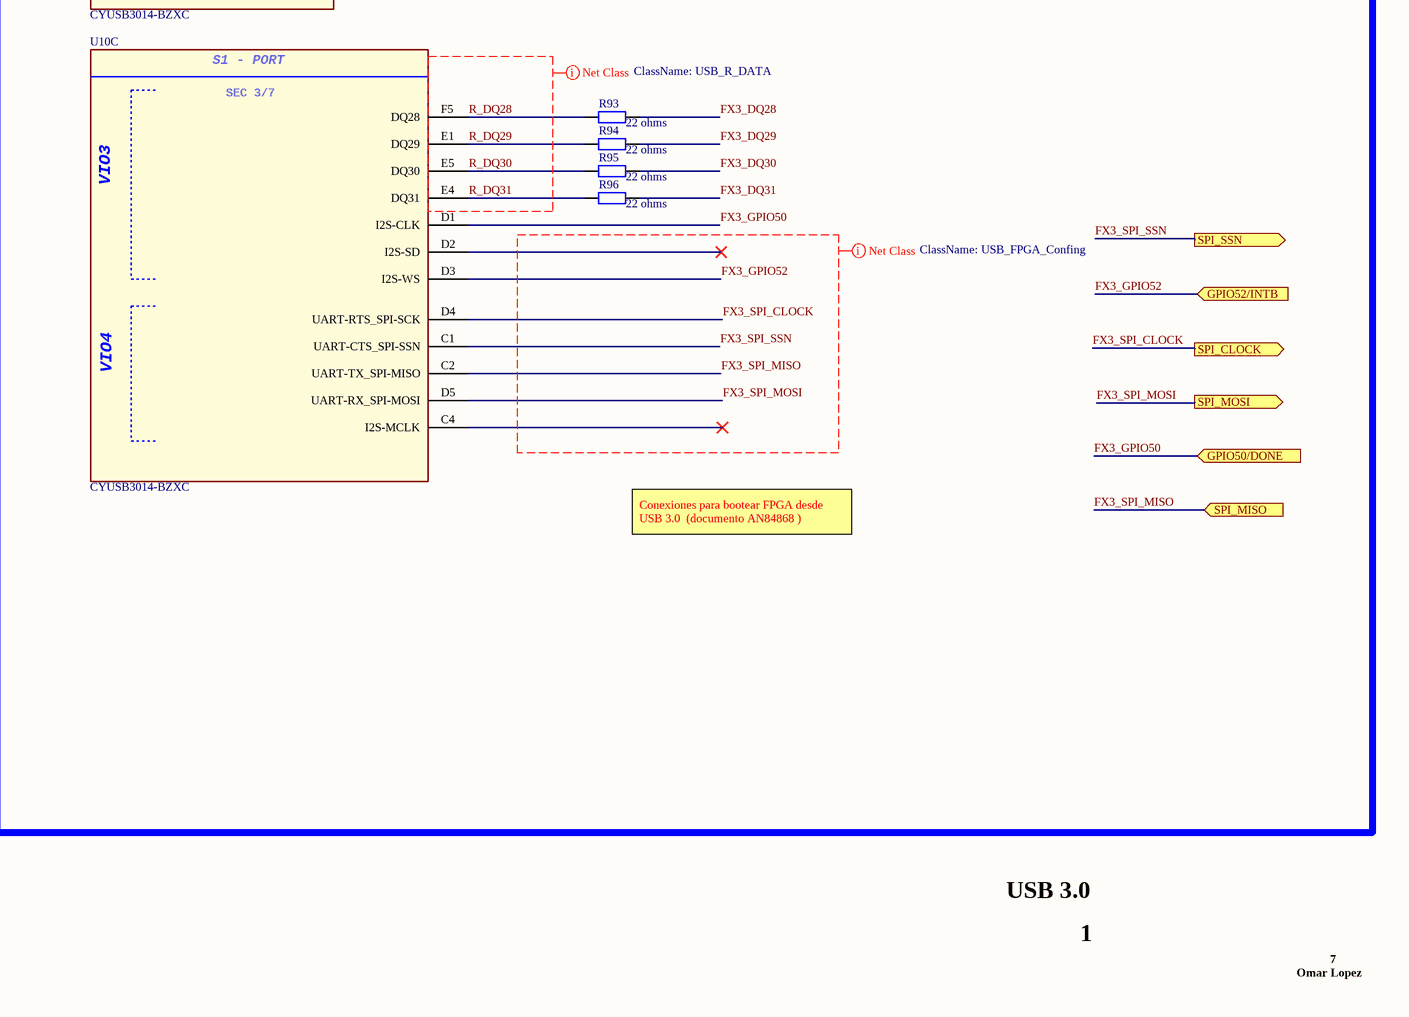
[diagram p11: USB3.0.SchDoc, bottom right]

### Parts
C144  Cap  value 13pF  [GRM0402MurataCap]
C145  Cap  value 13pF  [GRM0402MurataCap]
C146  value 0.01uF  [GRM0402MurataCap]  (hidden comment: Cap)
C147  Cap  value 0.1uF  [GRM0402MurataCap]
C148  value 0.01uF  [GRM0402MurataCap]  (hidden comment: Cap)
C149  Cap  value 0.1uF  [GRM0402MurataCap]
C150  Cap  value 0.1uF  [GRM0402MurataCap]
C151  Cap  value 0.1uF  [GRM0402MurataCap]
C152  value 0.01uF  [GRM0402MurataCap]  (hidden comment: Cap)
C153  Cap  value 0.1uF  [GRM0402MurataCap]
C154  Cap  value 22uF  [GRM0805MurataCap]
C155  Cap  value 0.1uF  [GRM0402MurataCap]
C156  value 0.01uF  [GRM0402MurataCap]  (hidden comment: Cap)
C157  Cap  value 0.1uF  [GRM0402MurataCap]
C158  Cap  value 0.1uF  [GRM0402MurataCap]
C159  value 0.01uF  [GRM0402MurataCap]  (hidden comment: Cap)
C160  Cap  value 0.1uF  [GRM0402MurataCap]
C161  value 0.01uF  [GRM0402MurataCap]  (hidden comment: Cap)
C162  Cap  value 0.1uF  [GRM0402MurataCap]
C163  value 0.01uF  [GRM0402MurataCap]  (hidden comment: Cap)
C164  Cap  value 0.1uF  [GRM0402MurataCap]
C165  value 0.01uF  [GRM0402MurataCap]  (hidden comment: Cap)
C166  Cap  value 0.1uF  [GRM0402MurataCap]
C167  value 0.01uF  [GRM0402MurataCap]  (hidden comment: Cap)
C168  Cap  value 0.1uF  [GRM0402MurataCap]
C169  Cap  value 2.2uF  [GRM0402MurataCap]
C170  Cap  value 0.1uF  [GRM0402MurataCap]
C171  Cap  value 22uF  [GRM0805MurataCap]
C172  Cap  value 0.1uF  [GRM0402MurataCap]
C173  Cap  value 0.1uF  [GRM0402MurataCap]
C174  Cap  value 22uF  [GRM0805MurataCap]
C175  Cap  value 0.1uF  [GRM0402MurataCap]
C176  value 0.01uF  [GRM0402MurataCap]  (hidden comment: Cap)
C177  value 0.1uF  [GRM0402MurataCap]
C178  value 0.1uF  [GRM0402MurataCap]
C179  value 0.1uF  [GRM0402MurataCap]
C180  Cap  value 0.1uF  [GRM0402MurataCap]
D4  82401444  [MSOP-10L]
J6  692622030100  [692622030100]
L9  MPZ2012S601A  value 600 Ohms  [MPZ2012]
L10  MPZ2012S601A  value 600 Ohms  [MPZ2012]
L11  MPZ2012S601A  value 600 Ohms  [MPZ2012]
L12  MPZ2012S601A  value 600 Ohms  [MPZ2012]
L13  BLM21PG221SN1D  value 220 Ohms  [BLM21]
L14  BLM21PG221SN1D  value 220 Ohms  [BLM21]
P8  Header 2  [Header2x1]
P9  Header 2  [Header2x1]
P10  Header 6X2  [HDR2X6]
R44  value 22 ohms  [RC0402N]
R45  value 22 ohms  [RC0402N]
R46  value 22 ohms  [RC0402N]
R47  value 22 ohms  [RC0402N]
R48  value 22 ohms  [RC0402N]
R49  value 10K  [RC0402N]
R50  value 22 ohms  [RC0402N]
R51  value 22 ohms  [RC0402N]
R52  value 22 ohms  [RC0402N]
R53  value 22 ohms  [RC0402N]
R54  value 22 ohms  [RC0402N]
R55  value 22 ohms  [RC0402N]
R56  value 22 ohms  [RC0402N]
R57  value 22 ohms  [RC0402N]
R58  value 22 ohms  [RC0402N]
R59  value 22 ohms  [RC0402N]
R60  value 22 ohms  [RC0402N]
R61  value 22 ohms  [RC0402N]
R62  value 22 ohms  [RC0402N]
R63  value 22 ohms  [RC0402N]
R64  value 22 ohms  [RC0402N]
R65  value 22 ohms  [RC0402N]
R66  value 22 ohms  [RC0402N]
R67  value 10K  [RC0402N]
R68  value 10K  [RC0402N]
R69  value 22 ohms  [RC0402N]
R70  value 10K  [RC0402N]
R71  value 2.2K  [RC0402N]
R72  value 2.2K  [RC0402N]
R73  value 22 ohms  [RC0402N]
R74  value 22 ohms  [RC0402N]
R75  value 22 ohms  [RC0402N]
R76  value 22 ohms  [RC0402N]
R77  value 22 ohms  [RC0402N]
R78  value 22 ohms  [RC0402N]
R79  value 22 ohms  [RC0402N]
R80  value 100k  [RC0402N]
R81  value 22 ohms  [RC0402N]
R82  value 22 ohms  [RC0402N]
R83  value 22 ohms  [RC0402N]
R84  value 22 ohms  [RC0402N]
R85  value 22 ohms  [RC0402N]
R86  value 22 ohms  [RC0402N]
R87  value 22 ohms  [RC0402N]
R88  value 22 ohms  [RC0402N]
R89  value 22 ohms  [RC0402N]
R90  value 22 ohms  [RC0402N]
R91  value 22 ohms  [RC0402N]
R92  value 22 ohms  [RC0402N]
R93  value 22 ohms  [RC0402N]
R94  value 22 ohms  [RC0402N]
R95  value 22 ohms  [RC0402N]
R96  value 22 ohms  [RC0402N]
R98  value 6.04K  [RC0402N]
R99  value 200 Ohm  [RC0402N]
S2  TL3301AF160QJ  [TL3301AF160QJ]
U10  CYUSB3014-BZXC  [BGA-121]  (parts A,B,C,D,E,F,G of 7)
U11  24LC256-I/SN  [SOIC8-N_MC]
Y3  NX2520SA-19.200000MHz-NBG1  [NX2520SA-19.200000MHz]

### Blocks framed on the sheet
Powe&Decoupling: C146-C171 C173-C176 L9-L12 U10
Clock&Boot: C144 C145 R49 R67 R68 R70-R72 U10 U11 Y3
Data&Control: C172 R44-R48 R50-R66 R69 R73-R96 S2 U10
PowerPathControl: P8 P9
JTAG: P10
Interface: C177-C180 D4 J6 L13 L14 R98 R99 U10

### Ports
CTL[12..0] (bidir), DQ[31..0] (bidir), FX3_INT_CTL (bidir), FX3_PCLK (out), GPIO50/DONE (in), GPIO52/INTB (in), SPI_CLOCK (out), SPI_MISO (in), SPI_MOSI (out), SPI_SSN (out)

### Nets
1.2V: P8.1
1.2V_USB: C146.2 C147.2 C148.2 C149.2 C150.2 C151.2 C152.2 C153.2 C154.1 C155.2 C156.2 L9.1 L10.1 L11.1 P8.2 U10.B10(VDD_EFVDDQ) U10.C3(VDD2) U10.E9(VDD4) U10.F11(VDD5) U10.H1(VDD1) U10.J11(VDD_SRAM_VDD2) U10.L5(VDD_SRAM_VDD1) U10.L7(VDD3)
1.8V: P9.1
1.8V_USB: C157.2 C158.2 C159.2 C160.2 C161.2 C162.2 C163.2 C164.2 C165.2 C166.2 C167.2 L12.1 P9.2 P10.11 R71.2 R72.2 R80.1 U10.B1(VIO4) U10.C11(VIO5) U10.E3(VIO3) U10.F1(VIO2) U10.H4(PMODE1) U10.H11(VIO1_2) U10.L9(VIO1_1) U11.8(VCC)
GND: C144.2 C145.2 C146.1 C147.1 C148.1 C149.1 C150.1 C151.1 C152.1 C153.1 C154.2 C155.1 C156.1 C157.1 C158.1 C159.1 C160.1 C161.1 C162.1 C163.1 C164.1 C165.1 C166.1 C167.1 C168.1 C169.2 C170.1 C171.2 C172.1 C173.1 C174.2 C175.1 C176.1 C179.1 C180.2 D4.3(VDD) D4.8(GND) J6.5(GND) J6.8(GND_DRAIN) L14.2 P10.2 P10.4 P10.6 P10.8 P10.10 P10.12 R49.2 R67.1 R68.1 R70.1 R98.1 R99.1 S2.3 S2.4 U10.A1(U3VSSQ) U10.A8(VSS12) U10.B7(AVSS) U10.B8(U2PLLVSSQ) U10.B9(U2AFEVSSQ) U10.D8(VSS5) U10.E2(VSS3) U10.G1(VSS1) U10.G11(VSS6) U10.K3(VSS10) U10.K4(VSS8) U10.L1(VSS2) U10.L2(VSS11) U10.L3(VSS9) U10.L6(VSS4) U10.L11(VSS7) U11.4(VSS) U11.7(WP) Y3.2(GND) Y3.4(GND)
VBUS: C180.1 L13.1 U10.E11(VBUS)
AVDD: C168.2 C169.1 L9.2 U10.A7(AVDD)
CapTX_N: C178.2 U10.A6(SSTXM)
CapTX_P: C177.2 U10.A5(SSTXP)
CVDDQ: C175.2 C176.2 L12.2 U10.B6(CVDDQ)
D_N: J6.2(D-) U10.A10(DM)
D_P: J6.3(D+) U10.A9(DP)
EsdSSRX_N: D4.1(I/O1) U10.A3(SSRXM)
EsdSSRX_P: D4.2(I/O2) U10.A4(SSRXP)
EsdSSTX_N: C178.1 D4.5(I/O4)
EsdSSTX_P: C177.1 D4.4(I/O3)
FX3_CTL0: R62.1  [project net F_CTL0]
FX3_CTL1: R63.1  [project net F_CTL1]
FX3_CTL2: R64.1  [project net F_CTL2]
FX3_CTL3: R65.1  [project net F_CTL3]
FX3_CTL4: R66.1  [project net F_CTL4]
FX3_CTL5: R69.1  [project net F_CTL5]
FX3_CTL6: R73.1  [project net F_CTL6]
FX3_CTL7: R74.1  [project net F_CTL7]
FX3_CTL8: R75.1  [project net F_CTL8]
FX3_CTL9: R76.1  [project net F_CTL9]
FX3_CTL10: R77.1  [project net F_CTL10]
FX3_CTL11: R78.1  [project net F_CTL11]
FX3_CTL12: R79.1  [project net F_CTL12]
FX3_DQ0: R44.1  [project net F_DQ0]
FX3_DQ1: R45.1  [project net F_DQ1]
FX3_DQ2: R46.1  [project net F_DQ2]
FX3_DQ3: R47.1  [project net F_DQ3]
FX3_DQ4: R48.1  [project net F_DQ4]
FX3_DQ5: R50.1  [project net F_DQ5]
FX3_DQ6: R51.1  [project net F_DQ6]
FX3_DQ7: R52.1  [project net F_DQ7]
FX3_DQ8: R53.1  [project net F_DQ8]
FX3_DQ9: R54.1  [project net F_DQ9]
FX3_DQ10: R55.1  [project net F_DQ10]
FX3_DQ11: R56.1  [project net F_DQ11]
FX3_DQ12: R57.1  [project net F_DQ12]
FX3_DQ13: R58.1  [project net F_DQ13]
FX3_DQ14: R59.1  [project net F_DQ14]
FX3_DQ15: R60.1  [project net F_DQ15]
FX3_DQ16: R81.1  [project net F_DQ16]
FX3_DQ17: R82.1  [project net F_DQ17]
FX3_DQ18: R83.1  [project net F_DQ18]
FX3_DQ19: R84.1  [project net F_DQ19]
FX3_DQ20: R85.1  [project net F_DQ20]
FX3_DQ21: R86.1  [project net F_DQ21]
FX3_DQ22: R87.1  [project net F_DQ22]
FX3_DQ23: R88.1  [project net F_DQ23]
FX3_DQ24: R89.1  [project net F_DQ24]
FX3_DQ25: R90.1  [project net F_DQ25]
FX3_DQ26: R91.1  [project net F_DQ26]
FX3_DQ27: R92.1  [project net F_DQ27]
FX3_DQ28: R93.1  [project net F_DQ28]
FX3_DQ29: R94.1  [project net F_DQ29]
FX3_DQ30: R95.1  [project net F_DQ30]
FX3_DQ31: R96.1  [project net F_DQ31]
FX3_GPIO50: U10.D1(I2S-CLK) ; port GPIO50/DONE  [project net FPGA_DONE]
FX3_GPIO52: U10.D3(I2S-WS) ; port GPIO52/INTB
FX3_I2C_SCL: R71.1 U10.D9(I2C-GPIO58_SCL) U11.6(SCL)
FX3_I2C_SDA: R72.1 U10.D10(I2C-GPIO59_SDA) U11.5(SDA)
FX3_INT_CTL: U10.L8(INT_N_CTL15) ; port FX3_INT_CTL  [project net F_INT_CTL]
FX3_JTAG_TCK: P10.3 U10.F6(TCK)
FX3_JTAG_TDI: P10.7 U10.E7(TDI)
FX3_JTAG_TDO: P10.9 U10.C10(TDO)
FX3_JTAG_TMS: P10.5 U10.E8(TMS)
FX3_JTAG_TRST_N: P10.1 U10.B11(TRST_N)
FX3_PCLK: R61.1 ; port FX3_PCLK  [project net F_PCLK]
FX3_R_USB2: R98.2 U10.C8(R_USB2)
FX3_R_USB3: R99.2 U10.B3(R_USB3)
FX3_RESET: C172.2 R80.2 S2.1 S2.2 U10.C5(RESET_N)
FX3_SPI_CLOCK: U10.D4(UART-RTS_SPI-SCK) ; port SPI_CLOCK  [project net FPGA_CCLK]
FX3_SPI_MISO: U10.C2(UART-TX_SPI-MISO) ; port SPI_MISO  [project net FPGA_SPI_MOSI]
FX3_SPI_MOSI: U10.D5(UART-RX_SPI-MOSI) ; port SPI_MOSI  [project net FPGA_SPI_MISO]
FX3_SPI_SSN: U10.C1(UART-CTS_SPI-SSN) ; port SPI_SSN  [project net FPGA_PROGRA_B]
OTG_ID: J6.4(ID) U10.C9(OTG_ID)
R_CTL0: R62.2 U10.K8(CTL0)
R_CTL1: R63.2 U10.K7(CTL1)
R_CTL2: R64.2 U10.J7(CTL2)
R_CTL3: R65.2 U10.H7(CTL3)
R_CTL4: R66.2 U10.G7(CTL4)
R_CTL5: R69.2 U10.G6(CTL5)
R_CTL6: R73.2 U10.K6(CTL6)
R_CTL7: R74.2 U10.H8(CTL7)
R_CTL8: R75.2 U10.G5(CTL8)
R_CTL9: R76.2 U10.H6(CTL9)
R_CTL10: R77.2 U10.K5(CTL10)
R_CTL11: R78.2 U10.J5(CTL11)
R_CTL12: R79.2 U10.H5(CTL12)
R_DQ0: R44.2 U10.F10(DQ0)
R_DQ1: R45.2 U10.F9(DQ1)
R_DQ2: R46.2 U10.F7(DQ2)
R_DQ3: R47.2 U10.G10(DQ3)
R_DQ4: R48.2 U10.G9(DQ4)
R_DQ5: R50.2 U10.F8(DQ5)
R_DQ6: R51.2 U10.H10(DQ6)
R_DQ7: R52.2 U10.H9(DQ7)
R_DQ8: R53.2 U10.J10(DQ8)
R_DQ9: R54.2 U10.J9(DQ9)
R_DQ10: R55.2 U10.K11(DQ10)
R_DQ11: R56.2 U10.L10(DQ11)
R_DQ12: R57.2 U10.K10(DQ12)
R_DQ13: R58.2 U10.K9(DQ13)
R_DQ14: R59.2 U10.J8(DQ14)
R_DQ15: R60.2 U10.G8(DQ15)
R_DQ16: R81.2 U10.K2(DQ16)
R_DQ17: R82.2 U10.J4(DQ17)
R_DQ18: R83.2 U10.K1(DQ18)
R_DQ19: R84.2 U10.J2(DQ19)
R_DQ20: R85.2 U10.J3(DQ20)
R_DQ21: R86.2 U10.J1(DQ21)
R_DQ22: R87.2 U10.H2(DQ22)
R_DQ23: R88.2 U10.H3(DQ23)
R_DQ24: R89.2 U10.F4(DQ24)
R_DQ25: R90.2 U10.G2(DQ25)
R_DQ26: R91.2 U10.G3(DQ26)
R_DQ27: R92.2 U10.F3(DQ27)
R_DQ28: R93.2 U10.F5(DQ28)
R_DQ29: R94.2 U10.E1(DQ29)
R_DQ30: R95.2 U10.E5(DQ30)
R_DQ31: R96.2 U10.E4(DQ31)
R_PCLK: R61.2 U10.J6(PCLK)
SSRX_N: D4.10(NC) J6.10(MicB_SSRX+)
SSRX_P: D4.9(NC) J6.9(MicB_SSRX-)
SSTX_N: D4.6(NC) J6.6(MicB_SSTX-)
SSTX_P: D4.7(NC) J6.7(MicB_SSTX+)
U3RXVDDQ: C170.2 C171.1 L10.2 U10.A2(U3RXVDDQ)
U3TXVDDQ: C173.2 C174.1 L11.2 U10.B5(U3TXVDDQ)
XTALIN: C144.1 U10.C6(XTALIN) Y3.1
XTALOUT: C145.1 U10.C7(XTALOUT) Y3.3
NetC179_2: C179.2 J6.Shell(Shield) L14.1
NetJ6_1: J6.1(VBUS) L13.2
NetR49_1: R49.1 U10.B2(FSLC0) U10.B4(FSLC1) U10.E6(FSLC2)
NetR67_2: R67.2 U11.1(A0)
NetR68_2: R68.2 U11.2(A1)
NetR70_2: R70.2 U11.3(A2)

Not connected (* = marked no-connect by the designer): U10 A11(NC)* C4(I2S-MCLK)* D2(I2S-SD)* D6(CLKIN_32)* D7(CLKIN)* D11(I2C-GPIO60_CHARGER-DETECT)* E10(VBAT)* F2(GPIO45)* G4(PMODE0)* L4(PMODE2)*

### Buses and harness runs
bus FX3_CTL[12..0] = port CTL[12..0]
bus FX3_DQ[31..0] = port DQ[31..0]

### Layout directives
differential pair; net class DIFF_90: CapTX_N, CapTX_P, D_N, D_P, EsdSSRX_N, EsdSSRX_P, EsdSSTX_N, EsdSSTX_P, SSRX_N, SSRX_P, SSTX_N, SSTX_P
net class USB 3.0: CapTX_N, CapTX_P, D_N, D_P, EsdSSRX_N, EsdSSRX_P
net class USB_R_Control: R_CTL0, R_CTL1, R_CTL2, R_CTL3, R_CTL4, R_CTL5, R_CTL6, R_CTL7, R_CTL8, R_CTL9, R_CTL10, R_CTL11, R_CTL12
net class USB_R_DATA: R_DQ0, R_DQ1, R_DQ2, R_DQ3, R_DQ4, R_DQ5, R_DQ6, R_DQ7, R_DQ8, R_DQ9, R_DQ10, R_DQ11, R_DQ12, R_DQ13, R_DQ14, R_DQ15, R_DQ16, R_DQ17, R_DQ18, R_DQ19, R_DQ20, R_DQ21, R_DQ22, R_DQ23, R_DQ24, R_DQ25, R_DQ26, R_DQ27, R_DQ28, R_DQ29, R_DQ30, R_DQ31
net class USB_FPGA_Confing: FX3_GPIO52, FX3_SPI_CLOCK, FX3_SPI_MISO, FX3_SPI_MOSI, FX3_SPI_SSN

### Notes on the sheet
- 3.Power System (AN70707 Pag.4)
- (near R49) 5. Frequency Select Configuration 19.2 MHz crystal  (AN70707 Pag.11)
- 5.Clock Crystal (AN70707 Pag.9)
- Sin Clock externo
- Memoria EEPROM
- (near R80) I2C boot mode PMODE[2:0]= Z1Z , on failure, USB boot is enabled  (AN70707 Pag.14)
- Modelos de protector ESD sacados de la placa SuperSpeed Explorer Kit.
- (near C178) Para PCB ver pag.17 de AN70707
- Swap Rx+ and Rx- to avoid crossing lines if necesary
- Conexiones para bootear FPGA desde USB 3.0  (documento AN84868 )
- Shield pins on the USB 3.0 receptacle to ground through an LC circuit for AC isolation. (AN70707 Pag.23)
- PCB!!!!!
  (INFO sacada de: EZ-USB® FX3™/FX3S™ Hardware Design Guidelines and Schematic Checklist AN70707)
  •The polarity can be swapped on the USB 3.0 differential pair
  •Keep the crystal trace as short as possible. Place the crystal within 2 cm from FX3.
  • Keep the power traces away from Hi-Speed data and clock lines.
  •Keep power traces as short as possible. Use larger vias (at least 30-mil pad, 15-mil hole) on power traces.
  •Use split planes on the powerlayer for different power domains.
  •The number of layers on the PCB should at least be four. To maintain 90 Ω differential impedance, use a solid
  reference power plane.
  •At least one immediate plane underneath these AC coupling capacitors should have a cut out in the shape of these capacitors to avoid extra capacitance on the lines because of the capacitor pads
  Routing:
  •Power trace widths should be ≥25 mils to reduce inductance.
  •Keep the USB signal line impedance at 90 Ω differential (±7%).
  •Minimize the trace length of USB lines as much as possible (<3 inches).
  •All data lines, command, and clock lines should be length-matched.
  •The maximum frequency of the GPIF II interface is 100 MHz. It is recommended that all lines on the GPIF II bus could be length matched within 500 mils
- USB2 and USB3 Reference Resistors (AN70707 Pag.16)
- USB 3.0
- 1
- Omar Lopez
- 7
- (in symbol 692622030100) Micro USB 3.0 Type B
- (in symbol FX3_121_BUMP_4, part A) P - PORT; SEC 1/7; VIO1
- (in symbol FX3_121_BUMP_4, part B) S0 - PORT; SEC 2/7
- (in symbol FX3_121_BUMP_4, part C) S1 - PORT; SEC 3/7
- (in symbol FX3_121_BUMP_4, part D) U - PORT; SEC 4/7; VBUS/
- (in symbol FX3_121_BUMP_4, part E) XTAL / CLK; SEC 5/7
- (in symbol FX3_121_BUMP_4, part F) MISC; SEC 6/7
- (in symbol FX3_121_BUMP_4, part G) POWER; SEC 7/7

### Library data of the parts
C144 C145 = Cap: Capacitor; Manufacturer: Murata; PartNumber: GRM1555C1H130GA01D; Tolerance: 2%; Descripción: SMD/SMT 0402 13pF 50volts C0G 2%; CostoVendedor1: 0.12; CostoVendedor2: 0.13; Vendedor1: Mouser; Vendedor2: Digi-Key; Package: 0402; DataSheet: http://www.mouser.com/ds/2/281/c02e-2905.pdf; LinkVendedor1: https://ar.mouser.com/ProductDetail/Murata-Electronics/GRM1555C1H130GA01D?qs=%2fha2pyFaduiGTOITjt%2fF7yG0aFmPUZSOtxgwyDJzTmOb1qvb0h0MQBblGInCC%252bk9; LinkVendedor2: https://www.digikey.com/product-detail/en/murata-electronics-north-america/GRM1555C1H130GA01D/490-8184-1-ND/4380477; Stock1: 1700; Stock2: 14000
C146 C148 C152 C156 C159 C161 C163 C165 C167 C176 = Cap: as C90 on sheet AD9364_Interface; Package: 0402; DataSheet: https://ar.mouser.com/datasheet/2/281/c03e-516224.pdf; LinkVendedor1: https://ar.mouser.com/ProductDetail/Murata-Electronics/GCG155L81E103KA01D?qs=sGAEpiMZZMs0AnBnWHyRQID2xuQsFd1G0H3MNkFLCyvrnbiUuoaHUg%3d%3d; Stock1: 8800
C147 C149-C151 C153 C155 C157 C158 C160 C162 C164 C166 C168 C170 C172 C173 C175 C177-C180 = Cap: Capacitor; Manufacturer: Murata; PartNumber: GRM155R71C104JA88J; Tolerance: 10%; Descripción: 16V  smd; CostoVendedor1: 0.038; Vendedor1: Mouser; Vendedor2: Digi-Key; Package: 0402; DataSheet: http://www.mouser.com/ds/2/281/c02e-2905.pdf; LinkVendedor1: https://ar.mouser.com/ProductDetail/Murata-Electronics/GRM155R71C104JA88J?qs=sGAEpiMZZMs0AnBnWHyRQFv7x1xn%252bYFdm0Vh6fxhMY51u8SdTXijCg%3d%3d; Stock1: 4800
C154 C171 C174 = Cap: Capacitor; Manufacturer: Murata; PartNumber: GRM219R61C226ME15L; Tolerance: 10%; Descripción: 25V  smd; CostoVendedor1: 0.45; CostoVendedor2: 0.51; Vendedor1: Mouser; Vendedor2: Digi-Key; Package: 0805; DataSheet: http://www.mouser.com/ds/2/281/product-794362.pdf; LinkVendedor1: https://ar.mouser.com/ProductDetail/Murata-Electronics/GRM219R61C226ME15L?qs=sGAEpiMZZMs0AnBnWHyRQFv7x1xn%252bYFdlpx3rHjqsYGFGOccM8ifgQ%3d%3d; LinkVendedor2: https://www.digikey.com/product-detail/en/murata-electronics-north-america/GRM219R61C226ME15L/490-9952-1-ND/5026415; Stock1: 23000; Stock2: 400000
C169 = Cap: Capacitor; Manufacturer: Murata; PartNumber: GRT155R61E225KE13D; Tolerance: 10%; Descripción: 16V  smd; CostoVendedor1: 0.31; Vendedor1: Mouser; Vendedor2: Digi-Key; Package: 0402; DataSheet: http://www.mouser.com/ds/2/281/product-794258.pdf; LinkVendedor1: https://ar.mouser.com/ProductDetail/Murata-Electronics/GRT155R61E225KE13D?qs=%2fha2pyFadugDz9MH5HufkUFjB67%2fqIb%252b2zKgUM%252bWVYEFYanDgYaJM0uBHf%2fw3BwI; Stock1: 13000
D4 = WE-TVS-SS,MSOP-10L, 82401444: TVS Diode WE-TVS-SS, VRWM=5V; Manufacturer: Würth Elektronik eiSos GmbH; Descripción: Supresores de descargas electrostáticas; CostoVendedor1: 1.48; Vendedor1: Mouser; Vendedor2: Digi-Key; DataSheet: http://www.mouser.com/ds/2/445/82401444-372914.pdf; PartNumber: 82401444; LinkVendedor1: https://ar.mouser.com/ProductDetail/Wurth-Electronics/82401444?qs=%2fha2pyFadugrqVOnhQc9hRTe12XdQqMCDj%2fJCcJVK2M%3d; Stock1: 2900
J6 = 692622030100: Micro USB 3.0 Type B Horizontal SMT WR-COM; Vendedor1: Mouser; Vendedor2: Digi-Key
L9-L12 = Inductor: Manufacturer: TDK; Descripción: Núcleos de ferrita Ferrite Chip Beads; CostoVendedor1: 0.12; CostoVendedor2: 0.11; Vendedor1: Mouser; Vendedor2: Digi-Key; DataSheet: http://www.mouser.com/ds/2/400/eads_commercial_power_mpz2012_en-923646.pdf; Package: 0805; PartNumber: MPZ2012S601A; LinkVendedor1: https://ar.mouser.com/ProductDetail/TDK/MPZ2012S601A?qs=sGAEpiMZZMtdyQheitOmRaspPRlp9Yc%252bsdFgCvfaA6I%3d; LinkVendedor2: https://www.digikey.com/product-detail/en/tdk-corporation/MPZ2012S601AT000/445-2206-1-ND/765104; Stock1: 120000; Stock2: 20000
L13 L14 = Inductor: Manufacturer: Murata; Descripción: Núcleos de ferrita 0805 220 OHM; Tolerance: 25%; CostoVendedor1: 0.10; Vendedor1: Mouser; Vendedor2: Digi-Key; DataSheet: http://www.mouser.com/ds/2/281/c31e-794748.pdf; Package: 0805; PartNumber: BLM21PG221SN1D; LinkVendedor1: https://ar.mouser.com/ProductDetail/Murata-Electronics/BLM21PG221SN1D?qs=%2fha2pyFadujxD5ks3AjdffkJPlzxWbOj5FSW5VIu4iL4EWSt9l651Q%3d%3d; Stock1: 450000
P8 P9 = Header 2: Header, 2-Pin; Manufacturer: TE Connectivity; PartNumber: 826629; Descripción: Header 2x1 step 2,54mm; CostoVendedor1: 0.18; Vendedor1: Mouser; Vendedor2: Digi-Key; DataSheet: https://ar.mouser.com/datasheet/2/418/NG_CD_826629_AC-673634.pdf; LinkVendedor1: https://ar.mouser.com/ProductDetail/TE-Connectivity-AMP/5-826629-0?qs=sGAEpiMZZMuSK2mCDyT9clxPLHEBGojU; Stock1: 3600
P10 = Header 6X2: Header, 6-Pin, Dual row; Vendedor1: Mouser; Vendedor2: Digi-Key
R44-R48 R50-R66 R69 R73-R79 R81-R96 = Res2: Resistor; Manufacturer: Panasonic; PartNumber: ERJ-2RKF22R0X; Tolerance: 1%; Descripción: 100mW 50V; CostoVendedor1: 0.021; Vendedor1: Mouser; Vendedor2: Digi-Key; Package: 0402; DataSheet: http://www.mouser.com/ds/2/315/AOA0000C86-911473.pdf; LinkVendedor1: https://ar.mouser.com/ProductDetail/Panasonic-Industrial-Devices/ERJ-2RKF22R0X?qs=%2fha2pyFadujciewGcSbxYI%2fad%2fmth8TfMt3TuGSupPsgbmCsjuiYug%3d%3d; Stock1: 520000
R49 R67 R68 R70 = Res2: as R1 on sheet AD9364_Interface; Package: 0402; DataSheet: http://www.mouser.com/ds/2/315/AOA0000C86-911473.pdf; LinkVendedor1: https://ar.mouser.com/ProductDetail/Panasonic-Industrial-Devices/ERJ-2RKF1002X?qs=%2fha2pyFadujciewGcSbxYCeocmJ1V0ffuiBNpRUU2nm5e2XaRJ685Q%3d%3d; Stock1: 2000000
R71 R72 = Res2: Resistor; Manufacturer: Panasonic; PartNumber: ERJ-2RKF2201X; Tolerance: 1%; Descripción: 100mW 50V; CostoVendedor1: 0.021; Vendedor1: Mouser; Vendedor2: Digi-Key; Package: 0402; DataSheet: http://www.mouser.com/ds/2/315/AOA0000C86-911473.pdf; LinkVendedor1: https://ar.mouser.com/ProductDetail/Panasonic-Industrial-Devices/ERJ-2RKF2201X?qs=%2fha2pyFadujciewGcSbxYBlJjTKWCkDhEeo%2fFoOyGLEXIXB9mWKCWw%3d%3d; Stock1: 130000
R80 = Res2: Resistor; Manufacturer: Panasonic; PartNumber: ERJ-2RKF1003X; Tolerance: 1%; Descripción: 100mW 50V; CostoVendedor1: 0.021; Vendedor1: Mouser; Vendedor2: Digi-Key; Package: 0402; DataSheet: http://www.mouser.com/ds/2/315/AOA0000C86-911473.pdf; LinkVendedor1: https://ar.mouser.com/ProductDetail/Panasonic-Industrial-Devices/ERJ-2RKF1003X?qs=%2fha2pyFadujciewGcSbxYJOA56ny1fqECTP0AcRmbHTZSqniIUcBDA%3d%3d; Stock1: 1000000
R98 = Res2: Resistor; Manufacturer: Panasonic; PartNumber: ERJ-P03F6041V; Tolerance: 1%; Descripción: Resistores de película gruesa - SMD 0603 6.04Kohm 1% Anti-Surge AEC-Q200; CostoVendedor1: 0.58; Vendedor1: Mouser; Vendedor2: Digi-Key; Package: 0603; DataSheet: http://www.mouser.com/ds/2/315/AOA0000C243-947438.pdf; LinkVendedor1: https://ar.mouser.com/ProductDetail/Panasonic/ERJ-P03F6041V?qs=sGAEpiMZZMu61qfTUdNhG6hHVqnyaoDdDJMdIuioqt4%3d; Stock1: 4600
R99 = Res2: Resistor; Manufacturer: Panasonic; PartNumber: ERJ-3EKF2000V; Tolerance: 1%; Descripción: Resistores de película gruesa - SMD 0603 200ohms 0.2W 1% AEC-Q200; CostoVendedor1: 0.58; Vendedor1: Mouser; Vendedor2: Digi-Key; Package: 0603; DataSheet: http://www.mouser.com/ds/2/315/AOA0000C243-947463.pdf; LinkVendedor1: https://ar.mouser.com/ProductDetail/Panasonic-Industrial-Devices/ERJ-3EKF2000V?qs=sGAEpiMZZMu61qfTUdNhGzRxdwze5h8Z%252bNUYPmXkyK8%3d; Stock1: 61000
S2 = IT-2175: Tactile Switch, DPST; Thru-Hole; Vertical; Rating DC 12V, 50mA (max); Manufacturer: E-Switch; Descripción: Interruptores táctiles SPST SMD J-LEAD; CostoVendedor1: 0.43; Vendedor1: Mouser; Vendedor2: Digi-Key; DataSheet: https://www.e-switch.com/system/asset/product_line/data_sheet/158/TL3301.pdf; Package: J; PartNumber: TL3301AF160QJ; CostoVendedor2: 0.43; LinkVendedor1: https://ar.mouser.com/ProductDetail/E-Switch/TL3301AF160QJ?qs=%2fha2pyFadujx3gv2iG25gcw5Jio7UDqaqTkcH4vR60LrUmuJb9BKTQ%3d%3d; LinkVendedor2: https://www.digikey.com/product-detail/en/e-switch/TL3301AF160QJ/EG4374CT-ND/1144804; Stock1: 2800; Stock2: 44000
U10 = FX3_121_BUMP_4: USB Controller; Manufacturer: Cypress Semiconductor; CostoVendedor1: 30.7; CostoVendedor2: 31.7; Vendedor1: Mouser; Vendedor2: Digi-Key; DataSheet: http://www.mouser.com/ds/2/100/001-52136_CYUSB301X_CYUSB201X_EZ-USB_R_FX3_SUPERSP-371593.pdf; Descripción: USB Controller; Package: BGA-121; PartNumber: CYUSB3014-BZXC; LinkVendedor1: https://ar.mouser.com/ProductDetail/Cypress-Semiconductor/CYUSB3014-BZXC?qs=sGAEpiMZZMtv%252bwxsgy%2fhiKzKeKykxm1HOnMAKcwg04A%3d; LinkVendedor2: https://www.digikey.com/product-detail/en/cypress-semiconductor-corp/CYUSB3014-BZXC/428-3182-ND/3679585; Stock1: 4000; Stock2: 3500
U11 = 24LC256-I/SN: 256Kbit, 400kHz, 2.5V, I2C Serial EEPROM, 8-Pin SOIC 150mil, Industrial Temperature; Manufacturer: Microchip; PartNumber: 24LC256T-I/SN; Descripción: EEPROM 32kx8 - 2.5V; CostoVendedor1: 0.92; Vendedor1: Mouser; Vendedor2: Digi-Key; DataSheet: http://ww1.microchip.com/downloads/en/DeviceDoc/20001203U.pdf; Package: SOIC8; LinkVendedor1: https://ar.mouser.com/ProductDetail/Microchip-Technology/24LC256T-I-SN?qs=sGAEpiMZZMuVhdAcoizlRfa9Ygym%252bTXjZOCyhyW7tm0%3d; Stock1: 5600
Y3 = Component_1: Cristales 19.2000MHz 10ppm 7pF -30C +85C; Manufacturer: NDK; PartNumber: EXS00A-CS05400; CostoVendedor2: 1.29; Vendedor1: Mouser; Vendedor2: Digi-Key; DataSheet: https://media.digikey.com/pdf/Data%20Sheets/NDK%20PDFs/NX2520SA-19.200000MHZ-NBG1.pdf; Descripción: Cristales 19.2000MHz 10ppm 7pF -30C +85C; Package: NX2520SA; LinkVendedor2: https://www.digikey.com/product-detail/en/ndk-america-inc/EXS00A-CS05400/644-1162-1-ND/3125551; Stock2: 8800